# EAGLE design board_rev2 (EAGLE 4.16)
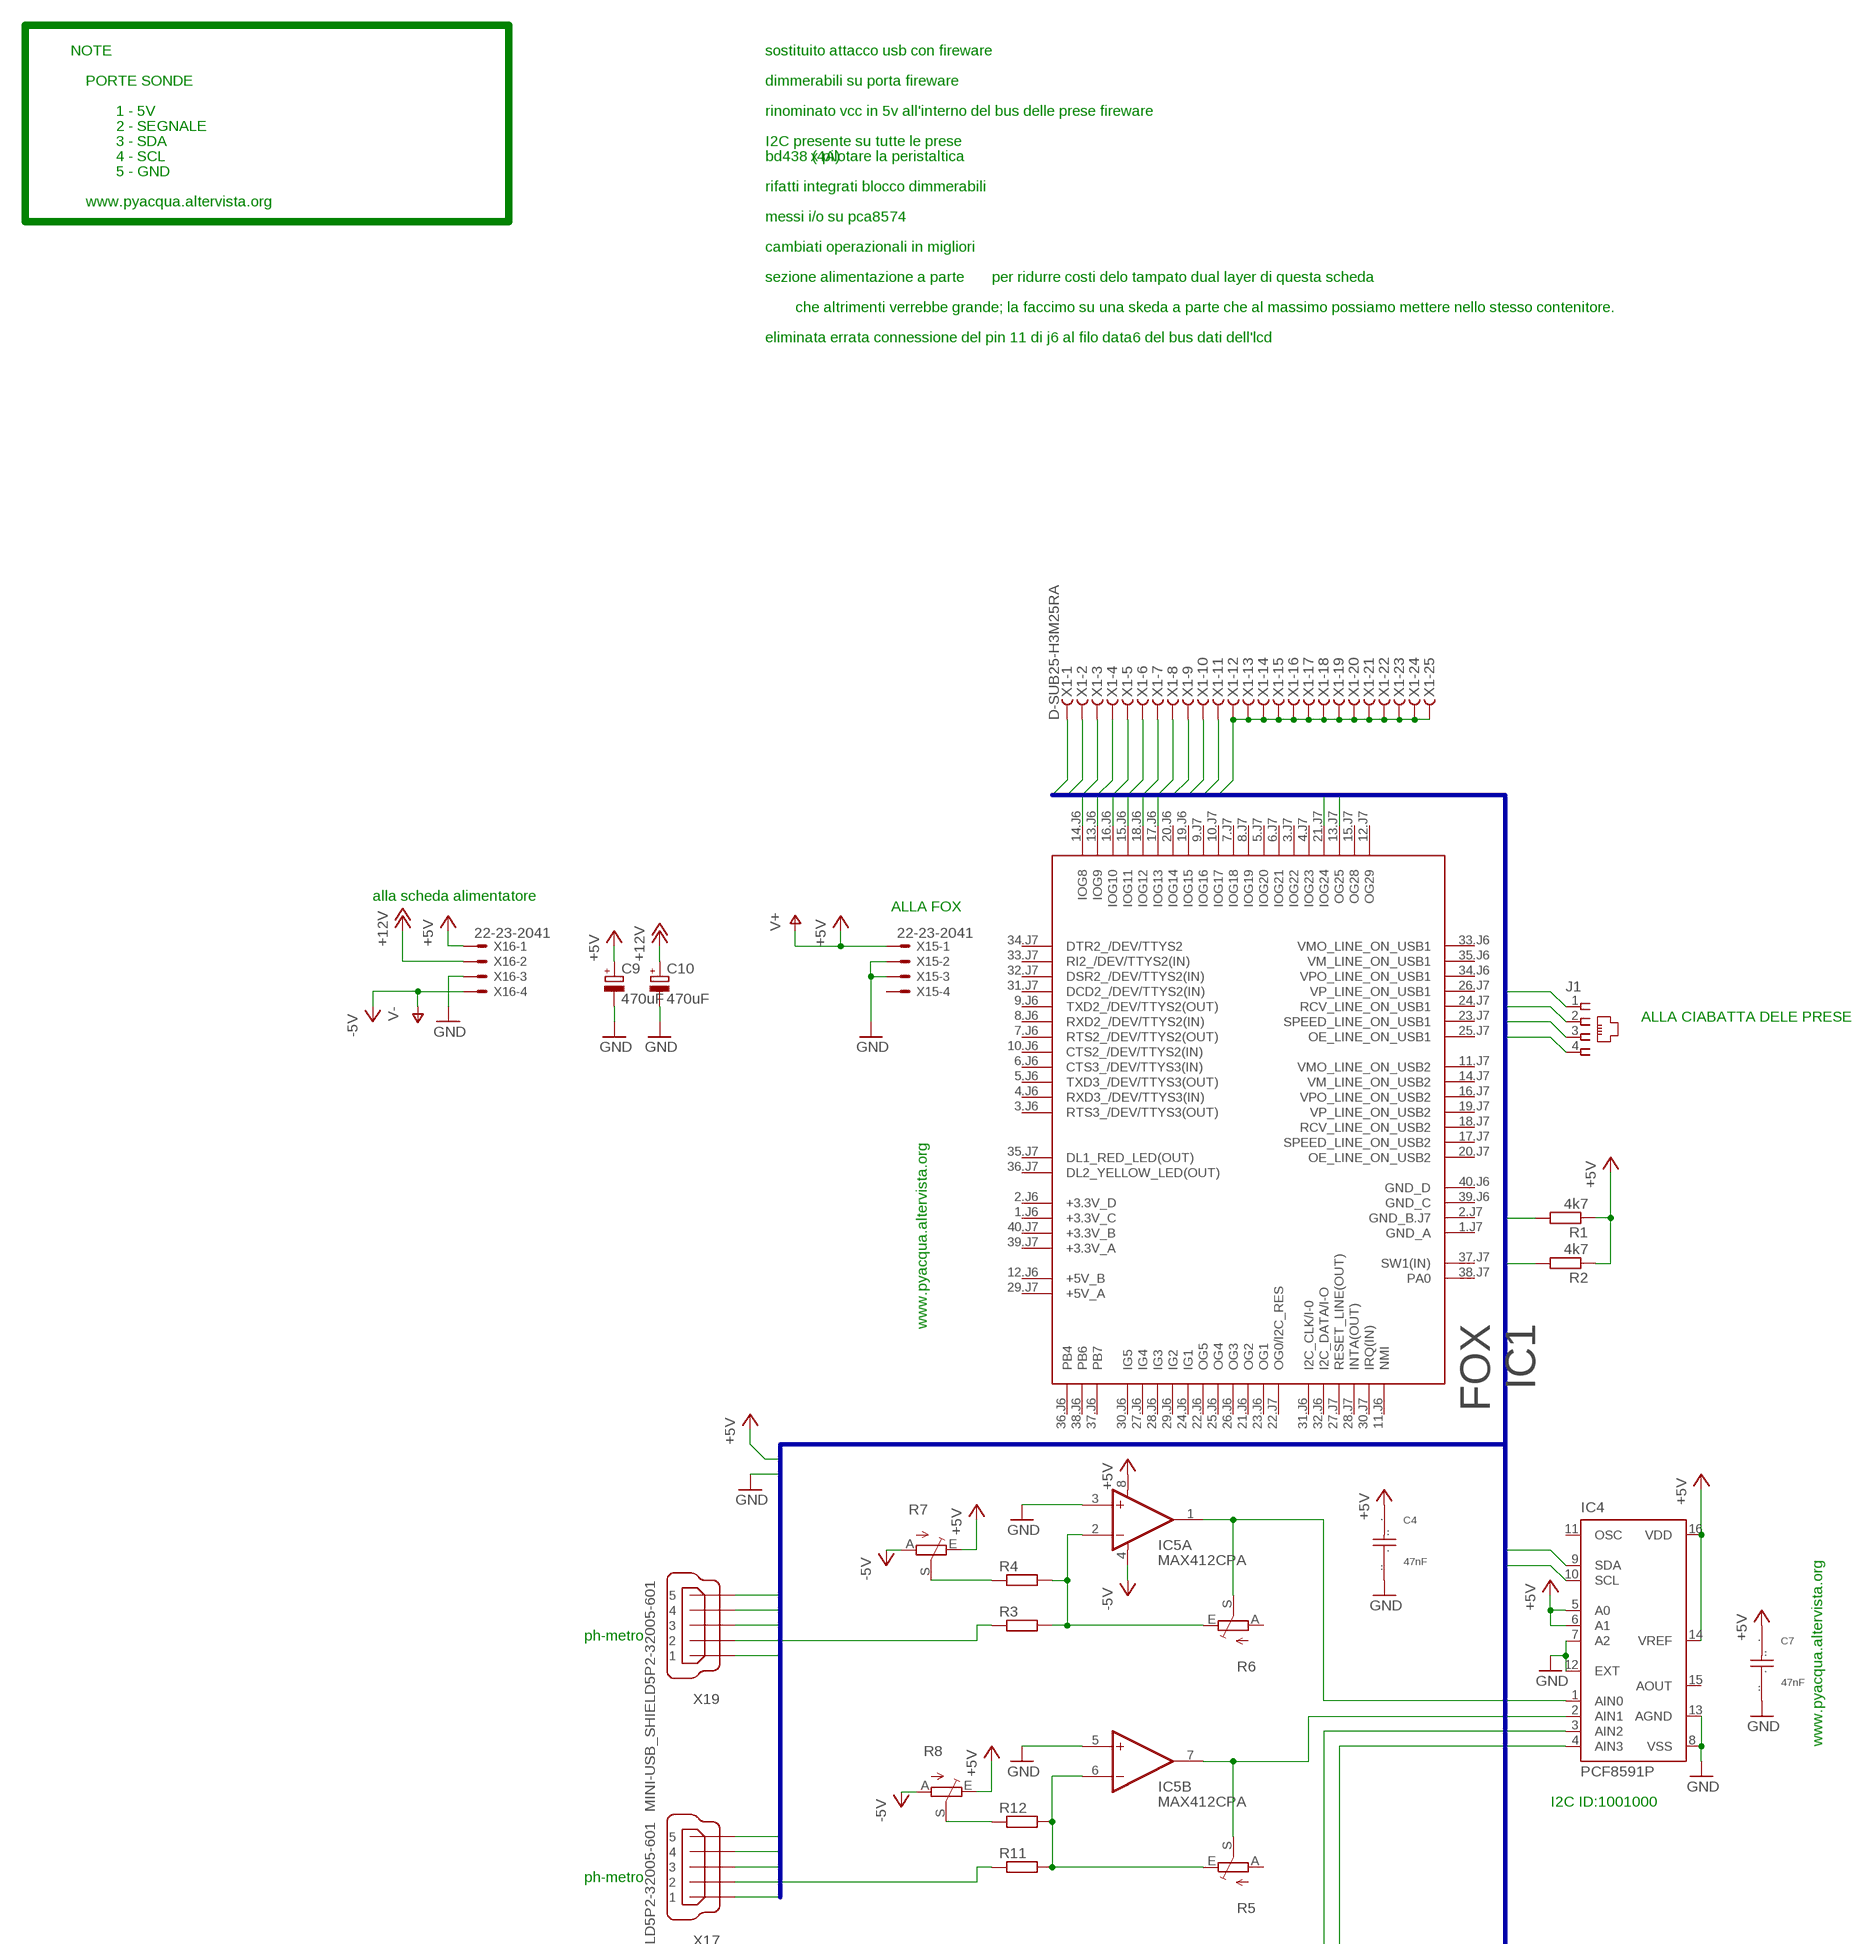
[diagram p0: schematic, sheet 1, part 1 of 2]
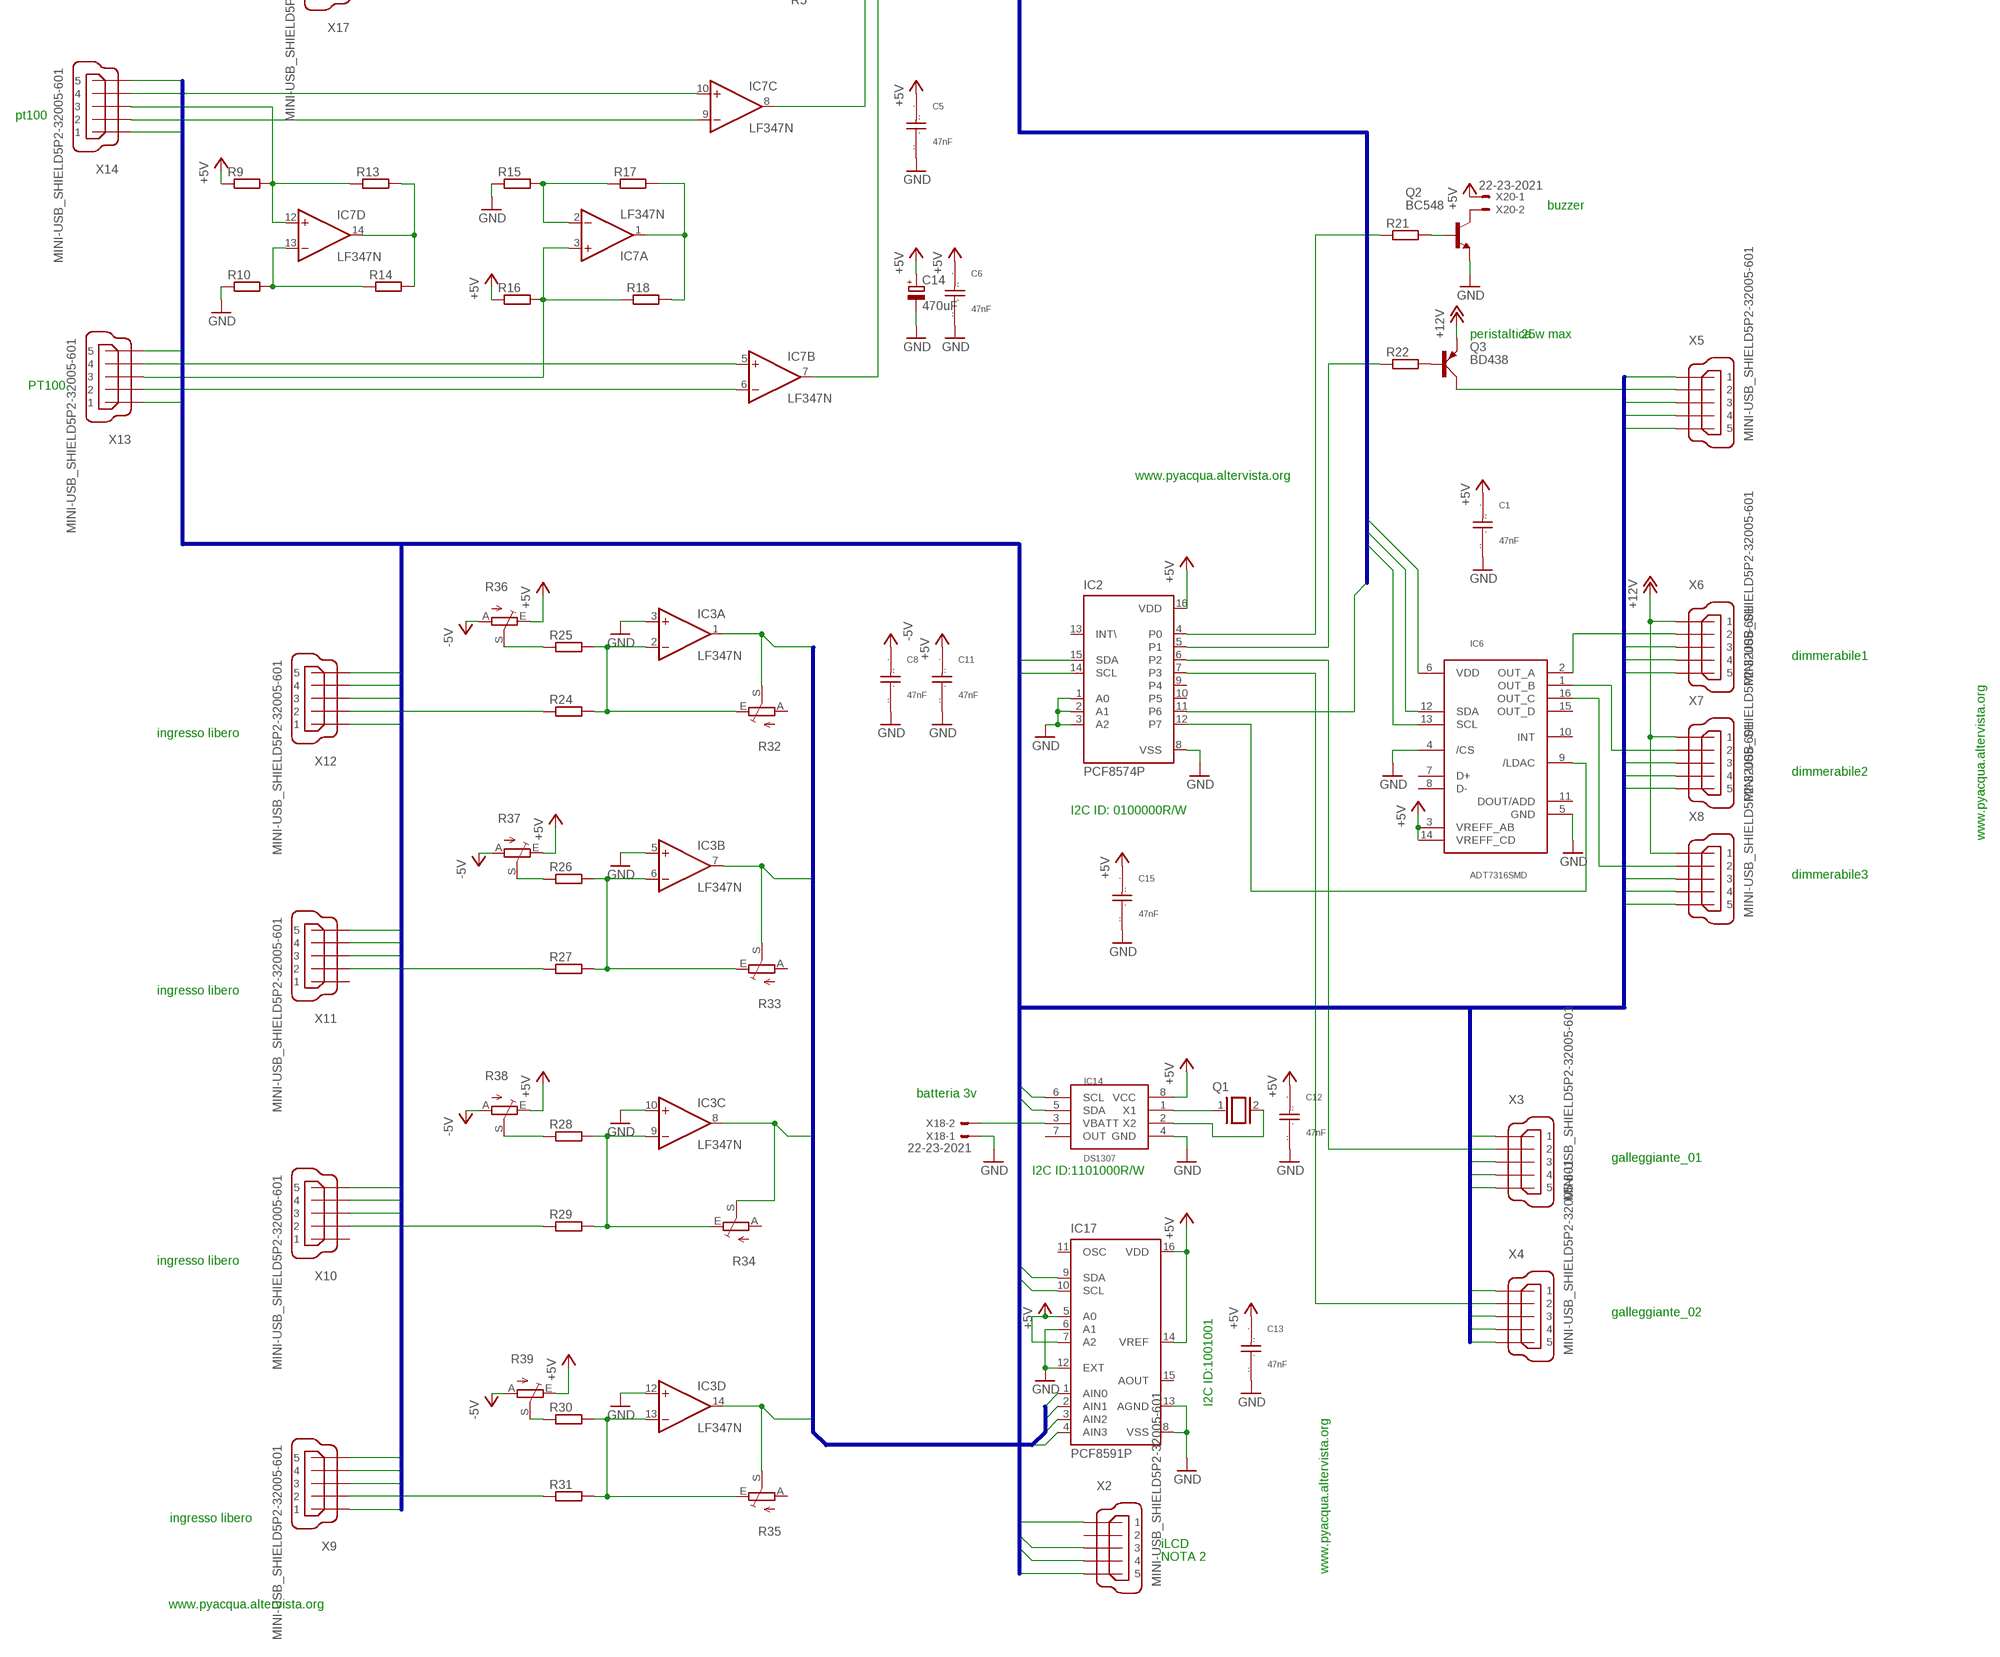
[diagram p1: schematic, sheet 1, part 2 of 2]

## Parts
C1  47nF  CAP_POLI  [CAP_POLI]
C4  47nF  CAP_POLI  [CAP_POLI]
C5  47nF  CAP_POLI  [CAP_POLI]
C6  47nF  CAP_POLI  [CAP_POLI]
C7  47nF  CAP_POLI  [CAP_POLI]
C8  47nF  CAP_POLI  [CAP_POLI]
C9  470uF  CPOL-EUE5-10.5  [E5-10,5]
C10  470uF  CPOL-EUE5-10.5  [E5-10,5]
C11  47nF  CAP_POLI  [CAP_POLI]
C12  47nF  CAP_POLI  [CAP_POLI]
C13  47nF  CAP_POLI  [CAP_POLI]
C14  470uF  CPOL-EUE2.5-6  [E2,5-6]
C15  47nF  CAP_POLI  [CAP_POLI]
IC1  FOX  [FOX]
IC2  PCF8574P  [DIL16]
IC3  LF347N  [DIL14]
IC4  PCF8591P  [DIL16]
IC5  MAX412CPA  [DIL08]
IC6  ADT7316SMD  [ADT7318SMD]
IC7  LF347N  [DIL14]
IC14  DS1307  [DS1307]
IC17  PCF8591P  [DIL16]
J1  520242-2  [520242-2]
Q1  XTAL  [Q]
Q2  BC548  [TO92-EBC]
Q3  BD438  [TO126AV]
R1  4k7  R-EU_0207/10  [0207/10]
R2  4k7  R-EU_0207/10  [0207/10]
R3  R-EU_0207/10  [0207/10]
R4  R-EU_0207/10  [0207/10]
R5  TRIM_EU-CT6  [CT6]
R6  TRIM_EU-CT6  [CT6]
R7  TRIM_EU-B25P  [B25P]
R8  TRIM_EU-B25P  [B25P]
R9  R-EU_0207/10  [0207/10]
R10  R-EU_0207/10  [0207/10]
R11  R-EU_0207/10  [0207/10]
R12  R-EU_0207/10  [0207/10]
R13  R-EU_0207/10  [0207/10]
R14  R-EU_0207/10  [0207/10]
R15  R-EU_0207/10  [0207/10]
R16  R-EU_0207/10  [0207/10]
R17  R-EU_0207/10  [0207/10]
R18  R-EU_0207/10  [0207/10]
R21  R-EU_0207/10  [0207/10]
R22  R-EU_0207/10  [0207/10]
R24  R-EU_0207/10  [0207/10]
R25  R-EU_0207/10  [0207/10]
R26  R-EU_0207/10  [0207/10]
R27  R-EU_0207/10  [0207/10]
R28  R-EU_0207/10  [0207/10]
R29  R-EU_0207/10  [0207/10]
R30  R-EU_0207/10  [0207/10]
R31  R-EU_0207/10  [0207/10]
R32  TRIM_EU-CT6  [CT6]
R33  TRIM_EU-CT6  [CT6]
R34  TRIM_EU-CT6  [CT6]
R35  TRIM_EU-CT6  [CT6]
R36  TRIM_EU-B25P  [B25P]
R37  TRIM_EU-B25P  [B25P]
R38  TRIM_EU-B25P  [B25P]
R39  TRIM_EU-B25P  [B25P]
X1  D-SUB25-H3M25RA  [H3M25RA]
X2  MINI-USB_SHIELD5P2-32005-601  [32005-601]
X3  MINI-USB_SHIELD5P2-32005-601  [32005-601]
X4  MINI-USB_SHIELD5P2-32005-601  [32005-601]
X5  MINI-USB_SHIELD5P2-32005-601  [32005-601]
X6  MINI-USB_SHIELD5P2-32005-601  [32005-601]
X7  MINI-USB_SHIELD5P2-32005-601  [32005-601]
X8  MINI-USB_SHIELD5P2-32005-601  [32005-601]
X9  MINI-USB_SHIELD5P2-32005-601  [32005-601]
X10  MINI-USB_SHIELD5P2-32005-601  [32005-601]
X11  MINI-USB_SHIELD5P2-32005-601  [32005-601]
X12  MINI-USB_SHIELD5P2-32005-601  [32005-601]
X13  MINI-USB_SHIELD5P2-32005-601  [32005-601]
X14  MINI-USB_SHIELD5P2-32005-601  [32005-601]
X15  22-23-2041  [22-23-2041]
X16  22-23-2041  [22-23-2041]
X17  MINI-USB_SHIELD5P2-32005-601  [32005-601]
X18  22-23-2021  [22-23-2021]
X19  MINI-USB_SHIELD5P2-32005-601  [32005-601]
X20  22-23-2021  [22-23-2021]

## Nets
5V: IC6.6(VDD) J1.4 X1.4 X2.1 X3.1 X4.1 X5.1 X9.1 X12.1 X13.1 X14.1 X17.1 X19.1 ; supply symbol labelled +5V
+5V: C1.. C4.. C5.. C6.. C7.. C9.+ C11.. C12.. C13.. C14.+ C15.. IC2.16(VDD) IC4.5(A0) IC4.6(A1) IC4.14(VREF) IC4.16(VDD) IC6.3(VREFF_AB) IC6.14(VREFF_CD) IC14.8(VCC) IC17.5(A0) IC17.7(A2) IC17.14(VREF) IC17.16(VDD) R1.1 R2.1 R7.E R8.E R9.1 R16.1 R36.E R37.E R38.E R39.E X15.1 X16.1 X20.1 ; supply symbol labelled V+
+12V: C10.+ Q3.E X6.1 X7.1 X8.1 X16.2
-5V: C8.. R7.A R8.A R36.A R37.A R38.A R39.A
CH0: IC3.14(D:OUT) IC17.1(AIN0) R35.S
CH1: IC3.8(C:OUT) IC17.2(AIN1) R34.S
CH2: IC3.7(B:OUT) IC17.3(AIN2) R33.S
CH3: IC3.1(A:OUT) IC17.4(AIN3) R32.S
CONTRASTO: IC2.11(P6) X1.5
DATA4: IC1.14.J6(IOG8) X1.8
DATA5: IC1.13.J6(IOG9) X1.9
DATA6: IC1.16.J6(IOG10) X1.10
DATA7: IC1.15.J6(IOG11) X1.11
E: IC1.17.J6(IOG13) X1.6
GND: C1... C4... C5... C6... C7... C8... C9.- C10.- C11... C12... C13... C14.- C15... IC2.1(A0) IC2.2(A1) IC2.3(A2) IC2.8(VSS) IC3.3(A:+IN) IC3.5(B:+IN) IC3.10(C:+IN) IC3.12(D:+IN) IC4.7(A2) IC4.8(VSS) IC4.12(EXT) IC4.13(AGND) IC5.3(A:+IN) IC5.5(B:+IN) IC6.4(/CS) IC6.5(GND) IC14.4(GND) IC17.6(A1) IC17.8(VSS) IC17.12(EXT) IC17.13(AGND) J1.1 Q2.E R10.1 R15.1 X1.3 X1.12 X1.13 X1.14 X1.15 X1.16 X1.17 X1.18 X1.19 X1.20 X1.21 X1.22 X1.23 X1.24 X1.25 X2.5 X3.5 X4.5 X5.5 X6.5 X7.5 X8.5 X9.5 X10.5 X11.5 X12.5 X13.5 X14.5 X15.2 X15.3 X16.3 X17.5 X18.1 X19.5
N$1: IC2.4(P0) R21.1
N$2: IC7.14(D:OUT) R13.2 R14.2
N$3: IC7.1(A:OUT) R17.2 R18.2
N$4: IC7.9(C:-IN) X14.2
N$5: IC7.10(C:+IN) X14.4
N$6: IC7.5(B:+IN) X13.4
N$7: IC7.6(B:-IN) X13.2
N$8: IC7.13(D:-IN) R10.2 R14.1
N$9: IC4.1(AIN0) IC5.1(A:OUT) R6.S
N$10: IC4.2(AIN1) IC5.7(B:OUT) R5.S
N$11: IC2.7(P3) X4.2
N$13: IC4.3(AIN2) IC7.8(C:OUT)
N$14: Q3.B R22.2
N$15: IC6.1(OUT_B) X7.2
N$16: IC2.5(P1) R22.1
N$17: IC6.16(OUT_C) X8.2
N$18: IC2.6(P2) X3.2
N$19: Q3.C X5.2
N$22: IC4.4(AIN3) IC7.7(B:OUT)
N$23: IC6.2(OUT_A) X6.2
N$25: IC2.12(P7) IC6.9(/LDAC)
N$26: Q2.B R21.2
N$27: Q2.C X20.2
N$28: IC7.2(A:-IN) R15.2 R17.1
N$29: IC7.12(D:+IN) R9.2 R13.1 X14.3
N$31: R8.S R12.1
N$32: IC7.3(A:+IN) R16.2 R18.1 X13.3
N$58: IC5.2(A:-IN) R3.2 R4.2 R6.E
N$60: R3.1 X19.2
N$62: R4.1 R7.S
N$63: IC5.6(B:-IN) R5.E R11.2 R12.2
N$69: R11.1 X17.2
N$74: IC14.3(VBATT) X18.2
N$83: IC14.1(X1) Q1.1
N$84: IC14.2(X2) Q1.2
N$113: IC3.2(A:-IN) R24.2 R25.2 R32.E
N$114: IC3.6(B:-IN) R26.2 R27.2 R33.E
N$115: IC3.9(C:-IN) R28.2 R29.2 R34.E
N$116: IC3.13(D:-IN) R30.2 R31.2 R35.E
N$117: R31.1 X9.2
N$119: R29.1 X10.2
N$121: R30.1 R39.S
N$122: R28.1 R38.S
N$123: R26.1 R37.S
N$124: R27.1 X11.2
N$125: R24.1 X12.2
N$126: R25.1 R36.S
RS: IC1.18.J6(IOG12) X1.7
SCL: IC1.13.J7(OG25) IC2.14(SCL) IC4.10(SCL) IC6.13(SCL) IC14.6(SCL) IC17.10(SCL) J1.2 R2.2 X1.2 X2.4 X3.4 X4.4 X5.4 X6.4 X7.4 X8.4 X9.4 X10.4 X11.4 X12.4 X17.4 X19.4
SDA: IC1.21.J7(IOG24) IC2.15(SDA) IC4.9(SDA) IC6.12(SDA) IC14.5(SDA) IC17.9(SDA) J1.3 R1.2 X1.1 X2.3 X3.3 X4.3 X5.3 X6.3 X7.3 X8.3 X9.3 X10.3 X11.3 X12.3 X17.3 X19.3
V-: X16.4 ; supply symbol labelled -5V
Unconnected: IC1.1.J6(+3.3V_C) IC1.1.J7(GND_A) IC1.2.J6(+3.3V_D) IC1.2.J7(GND_B.J7) IC1.3.J6(RTS3_/DEV/TTYS3(OUT)) IC1.3.J7(IOG22) IC1.4.J6(RXD3_/DEV/TTYS3(IN)) IC1.4.J7(IOG23) IC1.5.J6(TXD3_/DEV/TTYS3(OUT)) IC1.5.J7(IOG20) IC1.6.J6(CTS3_/DEV/TTYS3(IN)) IC1.6.J7(IOG21) IC1.7.J6(RTS2_/DEV/TTYS2(OUT)) IC1.7.J7(IOG18) IC1.8.J6(RXD2_/DEV/TTYS2(IN)) IC1.8.J7(IOG19) IC1.9.J6(TXD2_/DEV/TTYS2(OUT)) IC1.9.J7(IOG16) IC1.10.J6(CTS2_/DEV/TTYS2(IN)) IC1.10.J7(IOG17) IC1.11.J6(NMI) IC1.11.J7(VMO_LINE_ON_USB2) IC1.12.J6(+5V_B) IC1.12.J7(OG29) IC1.14.J7(VM_LINE_ON_USB2) IC1.15.J7(OG28) IC1.16.J7(VPO_LINE_ON_USB2) IC1.17.J7(SPEED_LINE_ON_USB2) IC1.18.J7(RCV_LINE_ON_USB2) IC1.19.J6(IOG15) IC1.19.J7(VP_LINE_ON_USB2) IC1.20.J6(IOG14) IC1.20.J7(OE_LINE_ON_USB2) IC1.21.J6(OG2) IC1.22.J6(OG5) IC1.22.J7(OG0/I2C_RES) IC1.23.J6(OG1) IC1.23.J7(SPEED_LINE_ON_USB1) IC1.24.J6(IG1) IC1.24.J7(RCV_LINE_ON_USB1) IC1.25.J6(OG4) IC1.25.J7(OE_LINE_ON_USB1) IC1.26.J6(OG3) IC1.26.J7(VP_LINE_ON_USB1) IC1.27.J6(IG4) IC1.27.J7(RESET_LINE(OUT)) IC1.28.J6(IG3) IC1.28.J7(INTA(OUT)) IC1.29.J6(IG2) IC1.29.J7(+5V_A) IC1.30.J6(IG5) IC1.30.J7(IRQ(IN)) IC1.31.J6(I2C_CLK/I-0) IC1.31.J7(DCD2_/DEV/TTYS2(IN)) IC1.32.J6(I2C_DATA/I-O) IC1.32.J7(DSR2_/DEV/TTYS2(IN)) IC1.33.J6(VMO_LINE_ON_USB1) IC1.33.J7(RI2_/DEV/TTYS2(IN)) IC1.34.J6(VPO_LINE_ON_USB1) IC1.34.J7(DTR2_/DEV/TTYS2) IC1.35.J6(VM_LINE_ON_USB1) IC1.35.J7(DL1_RED_LED(OUT)) IC1.36.J6(PB4) IC1.36.J7(DL2_YELLOW_LED(OUT)) IC1.37.J6(PB7) IC1.37.J7(SW1(IN)) IC1.38.J6(PB6) IC1.38.J7(PA0) IC1.39.J6(GND_C) IC1.39.J7(+3.3V_A) IC1.40.J6(GND_D) IC1.40.J7(+3.3V_B) IC2.9(P4) IC2.10(P5) IC2.13(INT\) IC4.11(OSC) IC4.15(AOUT) IC6.7(D+) IC6.8(D-) IC6.10(INT) IC6.11(DOUT/ADD) IC6.15(OUT_D) IC14.7(OUT) IC17.11(OSC) IC17.15(AOUT) R5.A R6.A R32.A R33.A R34.A R35.A X2.2 X2.M1(S1) X2.M2(S2) X3.M1(S1) X3.M2(S2) X4.M1(S1) X4.M2(S2) X5.M1(S1) X5.M2(S2) X6.M1(S1) X6.M2(S2) X7.M1(S1) X7.M2(S2) X8.M1(S1) X8.M2(S2) X9.M1(S1) X9.M2(S2) X10.1 X10.M1(S1) X10.M2(S2) X11.1 X11.M1(S1) X11.M2(S2) X12.M1(S1) X12.M2(S2) X13.M1(S1) X13.M2(S2) X14.M1(S1) X14.M2(S2) X15.4 X17.M1(S1) X17.M2(S2) X19.M1(S1) X19.M2(S2)

## Buses
BUS:SDA,SCL,GND,5V,DATA[4..7],CONTRASTO,E,RS
AN:CH[0..3]

## Notes on the sheet
- NOTE | sostituito attacco usb con fireware
- PORTE SONDE | dimmerabili su porta fireware
- 1 - 5V | rinominato vcc in 5v all'interno del bus delle prese fireware
- 2 - SEGNALE
- 3 - SDA | I2C presente su tutte le prese
- 4 - SCL | bd438 (4A) | x pilotare la peristaltica
- 5 - GND
- rifatti integrati blocco dimmerabili
- www.pyacqua.altervista.org
- messi i/o su pca8574
- cambiati operazionali in migliori
- sezione alimentazione a parte | per ridurre costi delo tampato dual layer di questa scheda
- che altrimenti verrebbe grande; la faccimo su una skeda a parte che al massimo possiamo mettere nello stesso contenitore.
- eliminata errata connessione del pin 11 di j6 al filo data6 del bus dati dell'lcd
- alla scheda alimentatore | ALLA FOX
- ALLA CIABATTA DELE PRESE
- www.pyacqua.altervista.org
- ph-metro
- www.pyacqua.altervista.org
- I2C ID:1001000
- ph-metro
- pt100
- buzzer
- peristaltica | 25w max
- PT100
- www.pyacqua.altervista.org
- dimmerabile1
- ingresso libero
- dimmerabile2
- I2C ID: 0100000R/W
- www.pyacqua.altervista.org
- dimmerabile3
- ingresso libero
- batteria 3v
- galleggiante_01
- I2C ID:1101000R/W
- ingresso libero
- galleggiante_02
- I2C ID:1001001
- ingresso libero
- iLCD
- NOTA 2
- www.pyacqua.altervista.org
- www.pyacqua.altervista.org

## Power pins joined to a net without a drawn wire
+5V: IC3.4(P:V+) IC5.8(A:V+) IC7.4(P:V+)
V-: IC3.11(P:V-) IC5.4(A:V-) IC7.11(P:V-)

## Library data of the parts
C1 C4-C8 C11-C13 C15 = aggiunte:CAP_POLI: Condensatore non elett 1 piazzola tra i 2 terminali
C9 C10 C14 = rcl:CPOL-EU: POLARIZED CAPACITOR, European symbol
IC1 = aggiunte:FOX: FOXBOARD Un sistema linux embedded completo www.acmesystem.it
IC2 = micro-philips:PCF8574: I2C-Bus Remote 8-bit I/O expander http://www.semiconductors.philips.com/acrobat_download/datasheets/PCF8574_4.pdf
IC3 IC7 = linear:LF347: OP AMP
IC4 IC17 = micro-philips:PCF8591: I2C-Bus D/A CONVERTER
IC5 = maxim:MAX412CPA: OP AMP
IC6 = aggiunte:ADT7316SMD: ADT7318 smd I2C DAC 4 Ch
IC14 = aggiunte:DS1307: DS1307 I2C DEVICE
J1 = con-amp:520242-2: AMP connector
Q1 = special:XTAL: CRYSTAL
Q2 = transistor-npn:BC548*: NPN Transistor
Q3 = transistor-power:BD438: PNP TRANSISTOR
R1-R4 R9-R18 R21 R22 R24-R31 = rcl:R-EU_: RESISTOR, European symbol
R5-R8 R32-R39 = pot:TRIM_EU-: POTENTIOMETER
X1 = con-thomas-betts:D-SUB25-: D-Subminiatur Connector Source: Electronioc Interconnects European Edition 1998
X2-X14 X17 X19 = con-cypressindustries:MINI-USB_SHIELD5P2-: MINI USB-B R/A DIP 5pol. Source: www.cypressindustries.com
X15 X16 = con-molex:22-23-2041: .100" (2.54mm) Center Header - 4 Pin
X18 X20 = con-molex:22-23-2021: .100" (2.54mm) Center Header - 2 Pin

## Board
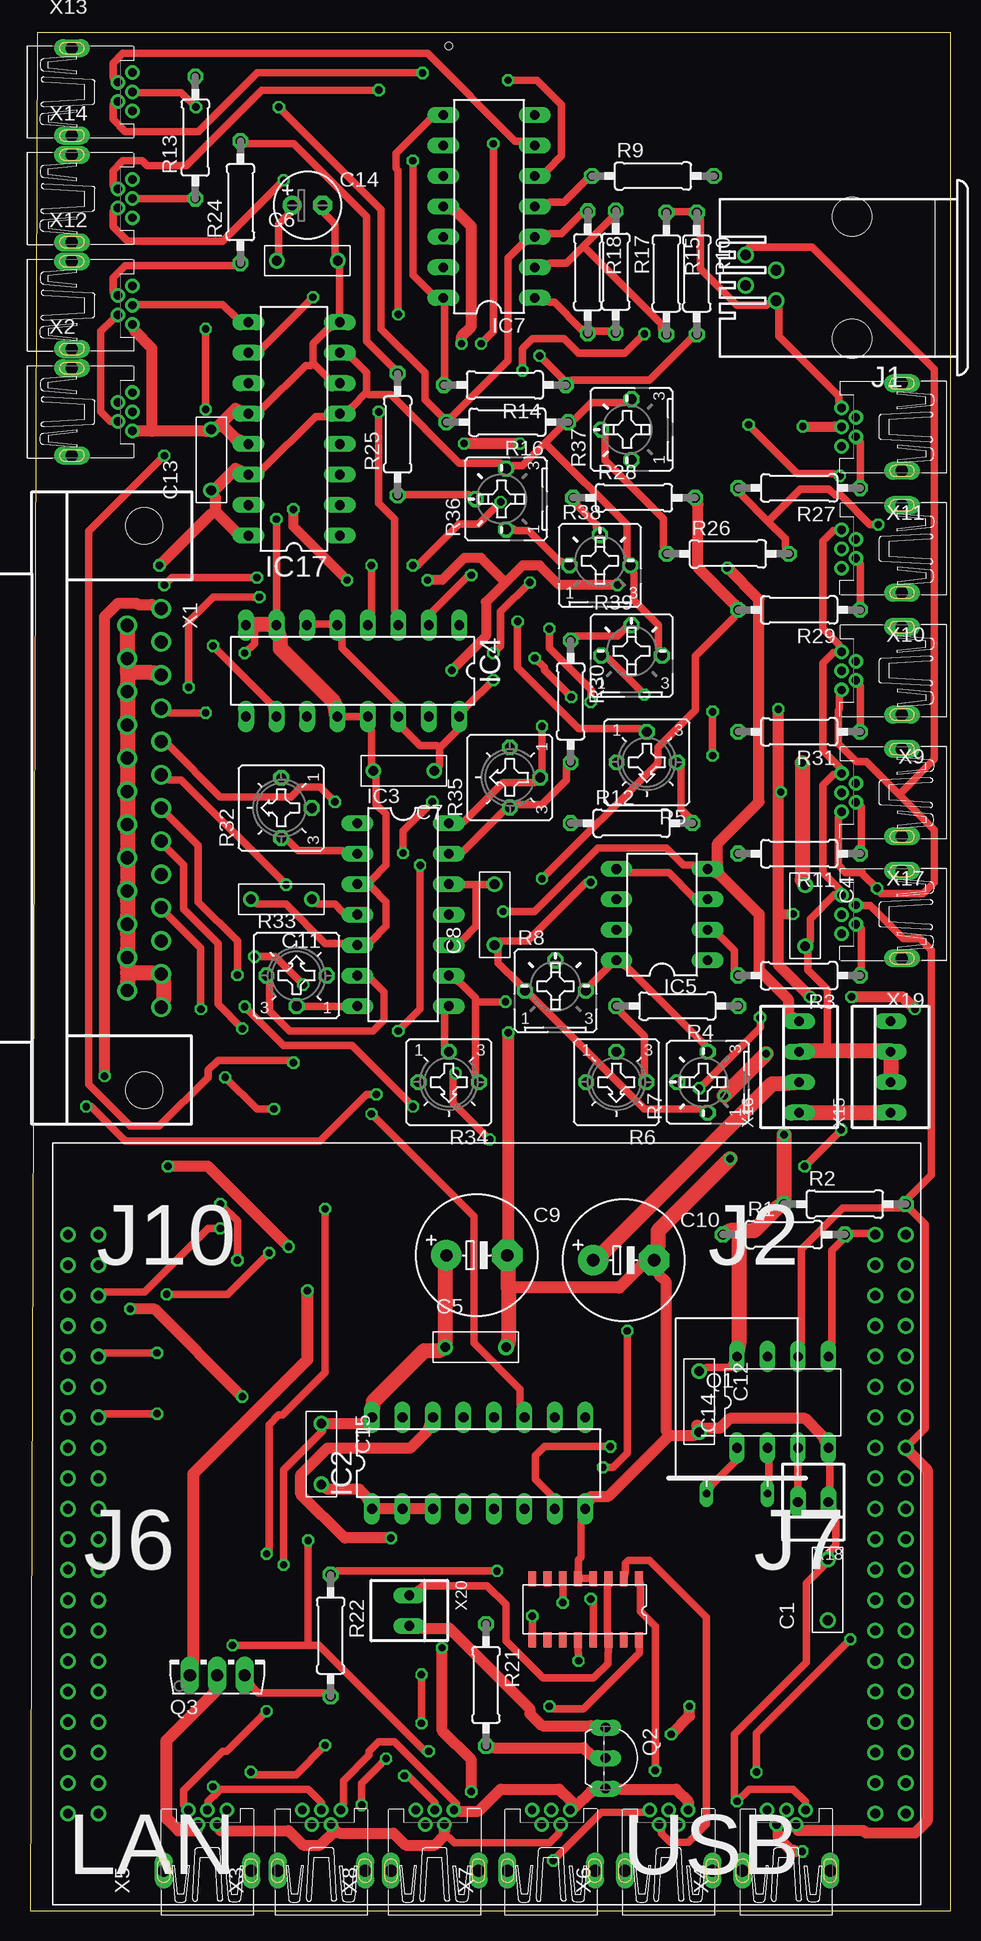
[diagram p2: board, top side]
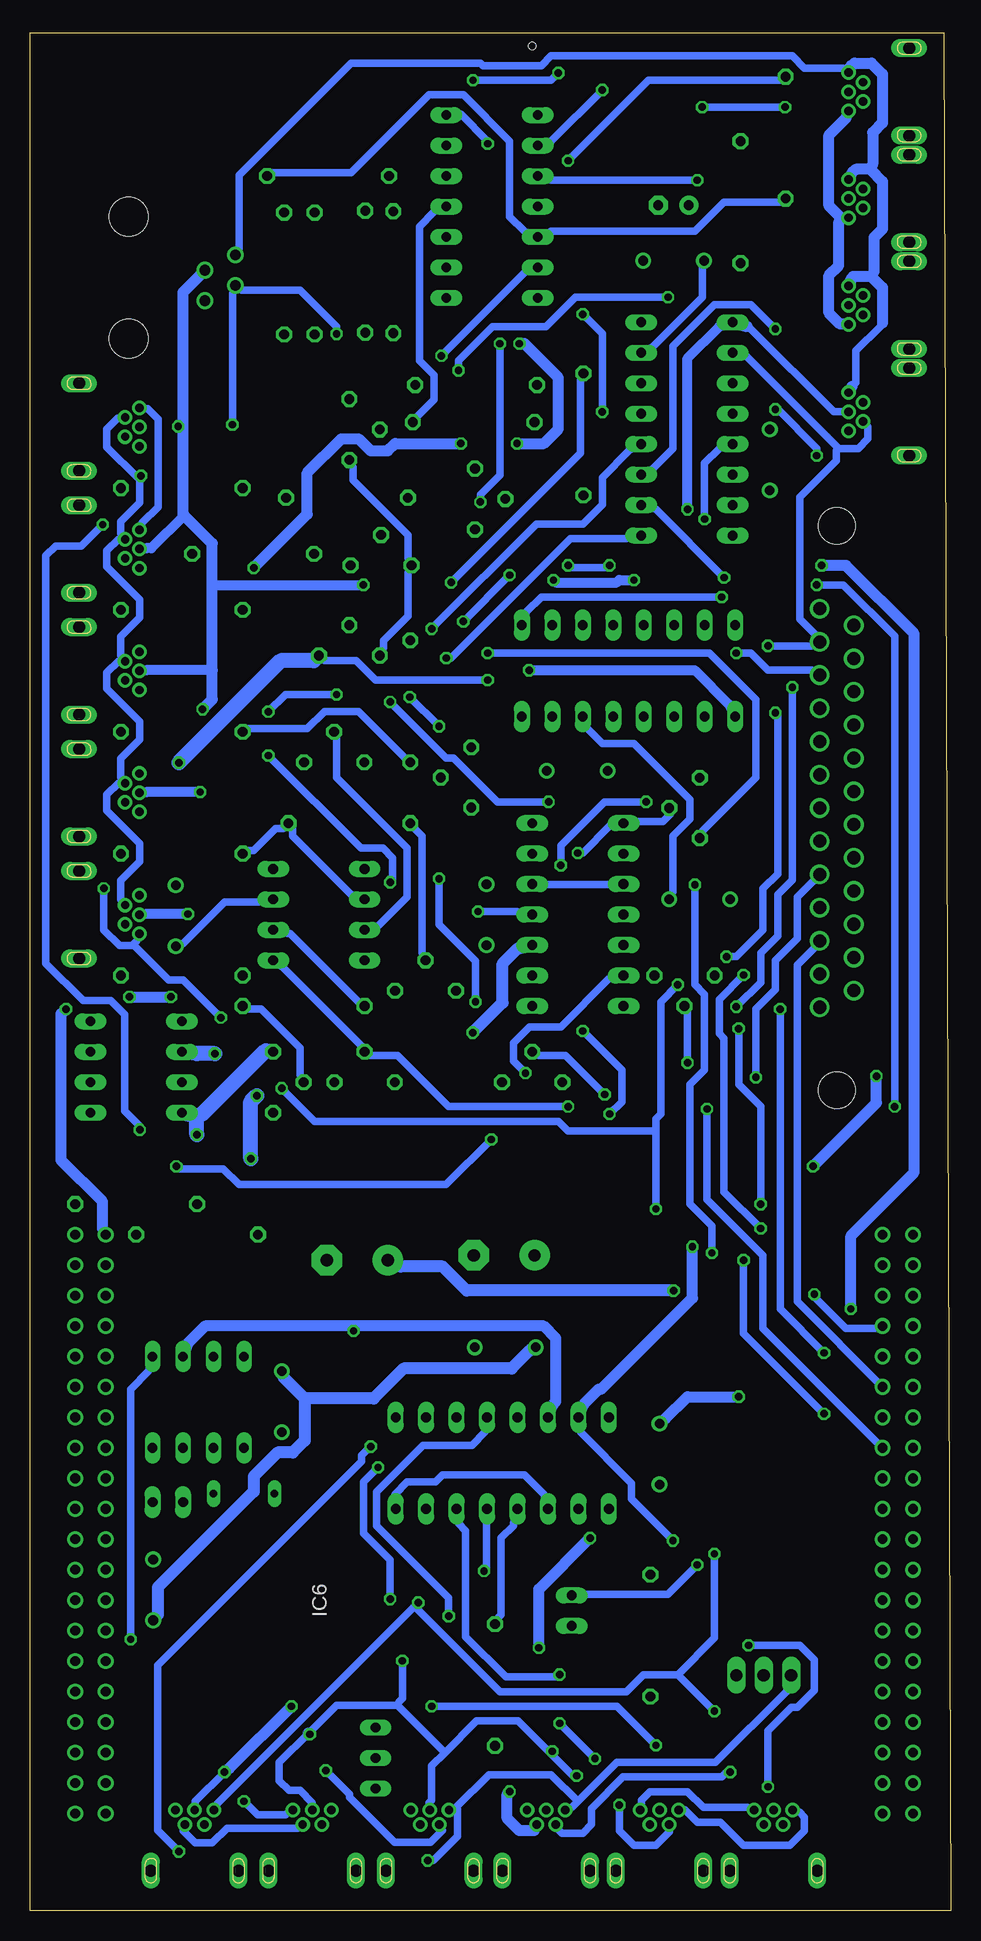
[diagram p3: board, bottom side, seen from below]

Size 76.79 x 156.54 mm. Coordinates in mm from the lower left corner, seen from the top.
Outline: 0,0 76.79,0 76.79,156.54 0.61,156.54 0,0
Copper layers (1*16): Top 0.035mm / dielectric 1.5mm / Bottom 0.035mm
Design rules "design rules": minimum track width 24mil, minimum drill 24mil, track to track 20mil, track to pad 20mil, pad to pad 20mil, via to via 20mil, smd to smd 20mil, copper to edge 40mil, drill to drill 8mil, minimum pad ring 10mil, minimum via ring 8mil, stop-mask expansion 4mil, vias tented up to drill 0mil, thermal gap 10mil
Holes 0.6 mm at 34.92,155.41

### Footprints (pad centres in the part's own frame; a part is rotated, then mirrored left to right if it is on the bottom)
CAP_POLI = drill 0.8 round: . -5.08,0; .. 0,0
E5-10,5 = drill 1.016 pad 2.54 round: + -2.54,0 | drill 1.016 pad 2.54 octagon: - 2.54,0
E2,5-6 = drill 0.813 pad 1.6 round: + -1.27,0 | drill 0.813 pad 1.6 octagon: - 1.27,0
FOX = drill 0.8 pad 1.27 round: 1.J6 67.31,0; 1.J7 0,0; 2.J6 67.31,-2.54; 2.J7 0,-2.54; 3.J6 67.31,-5.08; 3.J7 0,-5.08; 4.J6 67.31,-7.62; 4.J7 0,-7.62; 5.J6 67.31,-10.16; 5.J7 0,-10.16; 6.J6 67.31,-12.7; 6.J7 0,-12.7; 7.J6 67.31,-15.24; 7.J7 0,-15.24; 8.J6 67.31,-17.78; 8.J7 0,-17.78; 9.J6 67.31,-20.32; 9.J7 0,-20.32; 10.J6 67.31,-22.86; 10.J7 0,-22.86; 11.J6 67.31,-25.4; 11.J7 0,-25.4; 12.J6 67.31,-27.94; 12.J7 0,-27.94; 13.J6 67.31,-30.48; 13.J7 0,-30.48; 14.J6 67.31,-33.02; 14.J7 0,-33.02; 15.J6 67.31,-35.56; 15.J7 0,-35.56; 16.J6 67.31,-38.1; 16.J7 0,-38.1; 17.J6 67.31,-40.64; 17.J7 0,-40.64; 18.J6 67.31,-43.18; 18.J7 0,-43.18; 19.J6 67.31,-45.72; 19.J7 0,-45.72; 20.J6 67.31,-48.26; 20.J7 0,-48.26; 21.J6 69.85,-48.26; 21.J7 2.54,-48.26; 22.J6 69.85,-45.72; 22.J7 2.54,-45.72; 23.J6 69.85,-43.18; 23.J7 2.54,-43.18; 24.J6 69.85,-40.64; 24.J7 2.54,-40.64; 25.J6 69.85,-38.1; 25.J7 2.54,-38.1; 26.J6 69.85,-35.56; 26.J7 2.54,-35.56; 27.J6 69.85,-33.02; 27.J7 2.54,-33.02; 28.J6 69.85,-30.48; 28.J7 2.54,-30.48; 29.J6 69.85,-27.94; 29.J7 2.54,-27.94; 30.J6 69.85,-25.4; 30.J7 2.54,-25.4; 31.J6 69.85,-22.86; 31.J7 2.54,-22.86; 32.J6 69.85,-20.32; 32.J7 2.54,-20.32; 33.J6 69.85,-17.78; 33.J7 2.54,-17.78; 34.J6 69.85,-15.24; 34.J7 2.54,-15.24; 35.J6 69.85,-12.7; 35.J7 2.54,-12.7; 36.J6 69.85,-10.16; 36.J7 2.54,-10.16; 37.J6 69.85,-7.62; 37.J7 2.54,-7.62; 38.J6 69.85,-5.08; 38.J7 2.54,-5.08; 39.J6 69.85,-2.54; 39.J7 2.54,-2.54; 40.J6 69.85,0; 40.J7 2.54,0
DIL16 = drill 0.813 long: 1 -8.89,-3.81; 2 -6.35,-3.81; 3 -3.81,-3.81; 4 -1.27,-3.81; 5 1.27,-3.81; 6 3.81,-3.81; 7 6.35,-3.81; 8 8.89,-3.81; 9 8.89,3.81; 10 6.35,3.81; 11 3.81,3.81; 12 1.27,3.81; 13 -1.27,3.81; 14 -3.81,3.81; 15 -6.35,3.81; 16 -8.89,3.81
DIL14 = drill 0.813 long: 1 -7.62,-3.81; 2 -5.08,-3.81; 3 -2.54,-3.81; 4 0,-3.81; 5 2.54,-3.81; 6 5.08,-3.81; 7 7.62,-3.81; 8 7.62,3.81; 9 5.08,3.81; 10 2.54,3.81; 11 0,3.81; 12 -2.54,3.81; 13 -5.08,3.81; 14 -7.62,3.81
DIL08 = drill 0.813 long: 1 -3.81,-3.81; 2 -1.27,-3.81; 3 1.27,-3.81; 4 3.81,-3.81; 5 3.81,3.81; 6 1.27,3.81; 7 -1.27,3.81; 8 -3.81,3.81
ADT7318SMD = smd 0.635 x 1.27: 1 -10.16,-1.27; 2 -8.89,-1.27; 3 -7.62,-1.27; 4 -6.35,-1.27; 5 -5.08,-1.27; 6 -3.81,-1.27; 7 -2.54,-1.27; 8 -1.27,-1.27; 9 -1.27,3.81; 10 -2.54,3.81; 11 -3.81,3.81; 12 -5.08,3.81; 13 -6.35,3.81; 14 -7.62,3.81; 15 -8.89,3.81; 16 -10.16,3.81
DS1307 = drill 0.8 long: 1 -8.89,-5.08; 2 -6.35,-5.08; 3 -3.81,-5.08; 4 -1.27,-5.08; 5 -1.27,2.54; 6 -3.81,2.54; 7 -6.35,2.54; 8 -8.89,2.54
520242-2 = drill 0.889 round: 1 -1.905,6.35; 2 -0.635,8.89; 3 0.635,6.35; 4 1.905,8.89 | hole 3.251: -5.08,0; 5.08,0
Q = drill 0.61 long: 1 -2.54,-7.62; 2 2.54,-7.62
TO92-EBC = drill 0.813 long: B 0,-1.27; C -2.54,-1.27; E 2.54,-1.27
TO126AV = drill 1.016 long: B 2.286,-1.27; C 0,-1.27; E -2.286,-1.27
0207/10 = drill 0.813 octagon: 1 -5.08,0; 2 5.08,0
CT6 = drill 0.813 octagon: A 2.515,0; E -2.515,0; S 0,-2.54
B25P = drill 0.813 octagon: A -2.54,0; E 2.54,0; S 0,2.54
H3M25RA = drill 1.092 round: 1 -16.612,1.422; 2 -13.843,1.422; 3 -11.074,1.422; 4 -8.306,1.422; 5 -5.537,1.422; 6 -2.769,1.422; 7 0,1.422; 8 2.769,1.422; 9 5.537,1.422; 10 8.306,1.422; 11 11.074,1.422; 12 13.843,1.422; 13 16.612,1.422; 14 -15.227,-1.422; 15 -12.459,-1.422; 16 -9.69,-1.422; 17 -6.921,-1.422; 18 -4.153,-1.422; 19 -1.384,-1.422; 20 1.384,-1.422; 21 4.153,-1.422; 22 6.921,-1.422; 23 9.69,-1.422; 24 12.459,-1.422; 25 15.227,-1.422 | hole 3.048: -23.52,0; 23.52,0
32005-601 = drill 0.7 pad 1.016 round: 1 2.825,1.6; 2 1.625,0.8; 3 2.825,0; 4 1.625,-0.8; 5 2.825,-1.6 | drill 1 pad 1.422 long: M1 -2.225,3.65; M2 -2.225,-3.65
22-23-2041 = drill 0.813 long: 1 -3.81,0; 2 -1.27,0; 3 1.27,0; 4 3.81,0
22-23-2021 = drill 0.813 long: 1 -1.27,0; 2 1.27,0

### Placement (x,y rotation side)
C1  66.52,29.27 90 top
C4  64.64,80.38 270 top
C5  39.7,46.95 0 top
C6  25.67,137.53 0 top
C7  28.62,95.01 180 top
C8  38.73,85.56 90 top
C9  37.26,54.62 0 top
C10  49.5,54.22 0 top
C11  18.41,84.29 180 top
C12  55.8,39.89 270 top
C13  15.11,123.46 90 top
C14  23.13,142.15 0 top
C15  24.3,35.52 270 top
IC1  73.02,8.09 180 top
IC2  37.41,37.3 0 top
IC3  31.11,83.02 270 top
IC4  26.89,103.34 180 top
IC5  52.7,83.02 90 top
IC6  40.61,26.38 180 top
IC7  38.27,142.05 90 top
IC14  67.84,43.65 0 top
IC17  22.02,123.51 90 top
J1  68.55,136.11 90 top
Q1  58.95,42.38 0 top
Q2  49.25,12.71 270 top
Q3  15.62,20.89 0 top
R1  62.86,56.35 0 top
R2  67.94,58.89 0 top
R3  64.13,77.94 180 top
R4  53.97,75.4 180 top
R5  51.43,95.72 180 top
R6  48.89,69.05 180 top
R7  56.51,69.05 90 top
R8  43.81,76.67 0 top
R9  51.94,144.59 0 top
R10  55.6,136.46 270 top
R11  64.13,88.1 180 top
R12  50.16,90.64 0 top
R13  13.79,147.79 90 top
R14  39.59,127.17 180 top
R15  53.06,136.46 270 top
R16  39.8,124.07 180 top
R17  48.84,136.61 270 top
R18  46.5,136.56 270 top
R21  38.02,18.81 270 top
R22  25.06,22.92 270 top
R24  17.55,142.41 90 top
R25  30.65,123.05 90 top
R26  58.19,113.09 0 top
R27  64.13,118.58 180 top
R28  50.36,117.77 0 top
R29  64.13,108.42 180 top
R30  45.08,100.8 270 top
R31  64.13,98.26 180 top
R32  20.95,91.91 90 top
R33  22.22,77.94 0 top
R34  34.92,69.05 180 top
R35  40,94.45 90 top
R36  39.7,117.67 90 top
R37  50.16,123.46 90 top
R38  47.52,112.13 0 top
R39  50.16,104.61 0 top
X1  9.52,91.91 270 top
X2  5.71,124.93 0 top
X3  24.3,5.55 90 top
X4  63.06,5.55 90 top
X5  14.8,5.55 90 top
X6  53.26,5.55 90 top
X7  43.45,5.55 90 top
X8  33.75,5.55 90 top
X9  70.48,103.34 180 top
X10  70.48,113.5 180 top
X11  70.48,123.66 180 top
X12  5.71,133.82 0 top
X13  5.71,151.6 0 top
X14  5.71,142.71 0 top
X15  71.75,70.32 90 top
X16  64.13,70.32 90 top
X17  70.48,93.18 180 top
X18  65.3,34.05 180 top
X19  70.48,83.02 180 top
X20  31.62,25.01 270 top

### Tracks (layer width: path | path; a pad name or v marks a point on that pad's centre or on a via)
5V  (via drill 0.61)
  Top 0.61: X17.1 67.38,91.1 67.38,87.14 67.99,86.53 69.41,86.53 69.41,86.42 v70.63,85.2 70.94,84.8 74.49,84.8 75.41,85.71 75.41,90.08 72.46,93.03 | 72.46,93.03 69.72,95.77 68.91,95.77 67.38,97.3 67.38,100.04 67.48,100.14 67.48,101.16 X9.1 | 72.46,93.03 75.41,95.97 75.41,128.49 65.25,138.65 59.96,138.65 J1.4 | v19.73,16.62 16.38,13.27 16.07,13.27 12.82,10.02 12.82,8.8 X5.1 | v44.42,25.67 IC6.6 | v14.65,99.84 11.7,99.84 X1.4 | v18.71,79.52 20.44,79.52 v22.78,77.18 | v24.61,58.48 24.61,44.87 21.05,41.31 20.75,41.31 19.93,40.5 19.93,29.93 v19.73,29.73 | v60.88,74.44 60.88,73.62 v55.8,68.54
  Bottom 0.61: 68.19,80.53 68.3,80.43 69.31,80.43 70.63,81.75 v70.63,85.2 | 68.19,80.53 67.89,80.84 X19.1 | X5.1 12.62,8.19 12.21,7.79 12.21,6.67 13.43,5.45 17.29,5.45 19.22,7.38 21.15,7.38 22.17,8.39 X3.1 | 22.78,19.67 25.62,19.67 27.05,18.25 37.61,18.25 44.42,25.06 v44.42,25.67 61.18,8.9 X4.1 | v19.73,16.62 22.78,19.67 | v14.65,99.84 14.45,99.63 14.45,86.42 15.67,85.2 15.67,81.75 17.9,79.52 v18.71,79.52 | v22.78,77.18 24.2,75.76 24.2,66.41 24.61,66 24.61,64.99 | v24.61,58.48 24.61,64.99 | v19.73,29.73 19.73,22.72 22.78,19.67 | v60.88,74.44 64.03,77.58 65.25,77.58 68.19,80.53 | v55.8,68.54 53.06,65.8 32.74,65.8 31.92,64.99 24.61,64.99 | 8.25,127.06 7.95,127.37 7.95,130.01 5.91,132.04 5.71,132.35 | X13.1 8.96,153.58 12.21,153.58 13.23,154.6 33.35,154.6 34.16,153.78 39.04,153.78 39.24,153.99 50.01,153.99 59.36,144.64 59.36,138.54 J1.4
  Bottom 0.914: 5.71,132.35 5.71,135.29 6.62,136.21 | 6.62,136.21 8.15,136.21 8.35,136 X12.1 | 8.25,127.06 X2.1 | 6.73,145.15 7.95,145.15 8.25,144.84 X14.1 | 6.73,145.15 5.71,144.13 5.71,140.17 6.42,139.46 6.42,136.61 6.62,136.21 | X13.1 8.35,153.78 8.25,153.78 8.05,153.99 6.62,153.99 5.71,153.07 5.71,149.01 6.52,148.2 6.52,145.56 6.73,145.15
+5V  (via drill 0.61)
  Top 0.61: C11.. 24,83.88 25.42,83.88 26.03,83.27 IC3.4 | IC4.6 23.59,107.25 25.01,107.25 IC4.5 26.03,106.03 26.03,105.22 30.5,100.75 IC4.14 31.11,98.51 32.53,97.09 33.96,97.09 34.16,96.89 | 34.16,96.89 34.16,95.47 C7.. | 34.16,96.89 35.58,98.31 IC4.16 36.39,100.34 v38.63,102.58 | R8.E 46.76,77.18 48.18,78.6 IC5.8 49.8,78.6 56.31,72.1 R7.E | X15.1 70.53,66.61 65.25,66.61 X16.1 | C6.. 20.75,138.14 20.75,140.58 21.56,141.39 C14.+ | 28.06,126.56 26.84,125.34 IC17.5 24.61,124.52 23.79,124.52 19.32,120.05 IC17.14 | 28.06,126.56 28.06,128.18 26.84,129.4 IC17.7 | IC7.4 43.3,142.41 44.52,142.41 46.35,144.23 R9.1 | 42.95,122.34 41.07,120.46 40.25,120.46 R36.E 39.24,120.66 35.78,120.66 30.09,126.35 28.27,126.35 28.06,126.56 | 42.95,122.34 44.32,123.71 R16.1 45.49,124.37 46.81,125.69 49.55,125.69 R37.E | C12.. 56.41,45.28 58.34,45.28 IC14.8 | R39.E 52.4,105.22 52.4,107.15 50.36,109.18 50.36,111.52 R38.E 49.75,112.74 49.75,115.53 42.95,122.34 | 28.06,40.6 IC2.16 | v21.15,28.82 21.15,36.74 24.4,39.99 C15.. | X20.1 32.56,26.91 32.74,27.09 38.1,27.09 39.67,25.51 39.67,22.49 42.77,19.39 46.98,19.39 48.18,20.59 48.18,21.5 48.23,21.55 48.23,21.91 48.26,21.93 48.26,21.96 IC6.14 48.13,23.18 48.13,27.18 IC6.3
  Top 0.914: 15.46,116.6 17.09,114.97 IC17.16 | 15.46,116.6 15.46,117.82 C13.. | v10.79,112.13 15.06,116.4 15.46,116.6 | v8.35,50.15 10.38,50.15 v17.7,42.84 | C15.. 28.06,40.6
  Top 1.016: C13.. 15.63,118.68 17.13,120.18 IC17.14
  Top 1.27: 59.13,56.68 60.38,56.68 62.38,58.68 R2.1 62.88,59.43 v62.88,64.68 | 59.13,56.68 58.38,56.68 R1.1 | 59.13,56.68 59.13,47.43 IC14.8 | C9.+ 34.63,53.43 34.63,47.43 C5.. 34.13,46.68 32.88,46.68 28.63,42.43 IC2.16 | v64.38,95.68 64.38,85.93 C4..
  Bottom 0.61: C11.. 23.18,84.9 23.18,89.57 21.76,91 21.76,92.62 26.44,97.3 29.08,97.3 30.3,98.51 IC4.14 | v38.63,102.58 47.98,102.58 49.6,104.2 52.24,104.2 R39.E | C6.. 20.75,136.92 20.75,134.48 24.81,130.42 IC17.7 | IC7.4 43.1,141.59 44.32,140.37 44.32,129.2 43.1,127.98 43.1,125.95 44.52,124.52 R16.1 | v21.15,28.82 23.59,26.38 30.5,26.38 X20.1
  Bottom 0.914: v10.79,112.13 8.76,112.13 3.07,106.44 3.07,61.53 8.35,56.25 v8.35,50.15 | v17.7,42.84 21.97,42.84 23.79,41.01 C15..
  Bottom 1.016: 53.88,42.68 53.88,39.18 54.88,38.18 56.13,38.18 58.13,36.18 58.13,34.93 66.13,26.93 66.13,24.68 C1.. | 53.88,42.68 55.63,44.43 C12.. | 53.88,42.68 48.13,42.68 45.63,45.18 36.63,45.18 35.13,46.68 C5..
  Bottom 1.27: v62.88,64.68 62.88,66.18 | 62.88,66.18 X16.1 | 62.88,66.18 62.38,66.43 57.13,71.68 R7.E | v64.38,95.68 55.88,104.18 53.13,104.18 R39.E
+12V  (via drill 0.61)
  Top 0.61: v43.63,4.18 47.63,8.18 51.13,8.18 X6.1
  Top 1.016: v23.13,51.68 23.13,45.93 13.63,36.43 13.63,20.93 Q3.E
  Top 1.27: X16.2 62.88,68.93 61.88,68.93 47.88,54.93 C10.+
  Bottom 0.61: 31.11,9.11 27.86,12.36 19.63,12.36 13.74,18.25 Q3.E | 31.11,9.11 31.62,8.6 X8.1 | 41.27,8.6 38.53,11.34 33.35,11.34 31.11,9.11 | 41.27,8.6 X7.1 | v43.63,4.18 43.13,4.18 41.13,6.18 41.13,8.43 41.27,8.6
  Bottom 1.016: v23.13,51.68 40.38,51.68 42.38,53.68 45.88,53.68 C10.+
-5V  (via drill 0.61)
  Top 0.61: R7.A 55.9,66.82 51.23,66.82 41.68,76.37 R8.A 40.86,77.18 39.04,79.01 39.04,80.02 C8.. 39.24,80.84 41.47,80.84 46.35,85.71 v46.76,85.71 | R36.A 40.25,115.18 40.51,115.02 41.58,115.02 44.17,112.43 44.37,112.43 R38.A | v51.23,101.36 48.18,104.41 R39.A | v56.92,96.28 v56.92,99.94
  Bottom 0.61: v51.23,101.36 55.49,101.36 v56.92,99.94 | v56.92,96.28 49.2,88.56 47.37,88.56 46.55,87.74 46.55,85.92 v46.76,85.71 | R37.A 49.86,120.31 49.86,119.24 45.28,114.67 45.28,112.74 R38.A 45.28,111.52 45.28,107.91 47.32,105.88 47.32,105.22 R39.A
CH0  (via drill 0.61)
  Top 0.61: IC3.14 36.19,90.79 39.44,94.04 42.08,94.04 R35.S 42.69,95.06 v42.69,98.72 | v42.08,104.41 42.9,103.59 42.9,103.39 v45.13,101.16
  Bottom 0.61: v42.08,104.41 41.68,104.41 31.72,114.36 27.05,114.36 IC17.1 | v42.69,98.72 v45.13,101.16
CH1  (via drill 0.61)
  Top 0.61: R34.S 34.56,72.1 34.56,74.94 IC3.8 | v18.92,111.11 11.81,111.11 v11.2,110.5 | v4.69,67.02 5.1,67.02 7.95,64.17 24.2,64.17 28.06,68.03 v28.88,68.03
  Bottom 0.61: v18.92,111.11 24.61,116.8 IC17.2 | v11.2,110.5 8.96,110.5 4.69,106.24 v4.69,67.02 | v28.88,68.03 32.13,71.29 34.36,71.29 R34.S
CH2  (via drill 0.61)
  Top 0.61: R33.S 22.78,75.35 26.03,75.35 IC3.7 | v14.65,125.13 v14.65,131.84 | v11.2,121.27 4.9,114.97 4.9,68.85 8.35,65.39 10.79,65.39 14.85,69.46 14.85,70.07 15.67,70.88 21.76,70.88 v21.97,70.68
  Bottom 0.61: v14.65,131.84 16.68,133.87 19.73,133.87 23.18,130.42 23.18,121.88 24.81,120.26 IC17.3 | v14.65,125.13 14.45,125.13 11.2,121.88 v11.2,121.27 | v21.97,70.68 21.97,74.94 R33.S
CH3  (via drill 0.61)
  Top 0.61: v43.3,106.85 43.3,105.22 46.76,101.77 v46.76,100.75 | v33.55,92.42 31.11,89.98 v31.11,88.15
  Bottom 0.61: R32.S 23.39,91.4 24,90.79 26.03,90.79 IC3.1 28.47,90.39 30.7,88.15 v31.11,88.15 | v43.3,106.85 34.56,115.58 30.7,115.58 29.08,117.21 29.08,119.44 26.84,121.68 IC17.4 | v46.76,100.75 42.08,96.08 41.47,96.08 37.82,92.42 v33.55,92.42
CONTRASTO  (via drill 0.61)
  Top 0.61: v28.47,66.41 37,57.87 37,47.31 40.86,43.45 40.86,42.23 IC2.11 | v30.7,73.32 32.53,75.15 v32.53,87.14 | v25.42,92.42 24.2,93.64 22.58,93.64 21.76,92.82 15.87,92.82 11.6,97.09 X1.5
  Bottom 0.61: v28.47,66.41 27.45,67.42 27.45,70.07 v30.7,73.32 | v32.53,87.14 32.53,88.76 28.88,92.42 v25.42,92.42
DATA4  (via drill 0.61)
  Top 0.61: v10.59,41.41 6.32,41.41 IC1.14.J6 | v17.29,54.22 17.29,57.47 v15.87,58.89 | v17.7,73.52 15.67,75.55 15.67,80.63 12.82,83.48 12.82,87.14 11.4,88.56 X1.8
  Bottom 0.61: v10.59,41.41 17.29,48.12 v17.29,54.22 | v15.87,58.89 15.87,67.02 17.7,68.85 v17.7,73.52
DATA5  (via drill 0.61)
  Top 0.61: v20.34,66.82 18.92,66.82 v16.28,69.46
  Bottom 0.61: v20.34,66.82 20.34,59.3 15.67,54.62 15.67,48.53 IC1.13.J6 | v16.28,69.46 16.28,75.15 14.65,76.77 14.65,79.21 12.82,81.04 12.82,84.49 X1.9
DATA6  (via drill 0.61)
  Top 0.61: v10.59,46.49 6.32,46.49 IC1.16.J6 | v14.24,75.15 14.24,80.23 11.4,83.07 X1.10
  Bottom 0.61: v10.59,46.49 14.24,50.15 v14.24,75.15
DATA7
  Bottom 0.61: IC1.15.J6 12.82,50.76 12.82,78.8 11.4,80.23 X1.11
E  (via drill 0.61)
  Top 0.61: v11.4,51.37 16.48,51.37 v19.93,54.83 | v21.36,85.51 12.62,94.25 11.6,94.25 X1.6
  Bottom 0.61: v11.4,51.37 11.4,51.17 8.76,48.53 6.32,48.53 IC1.17.J6 | v19.93,54.83 19.93,57.06 21.76,58.89 21.76,68.85 20.54,70.07 20.54,76.37 21.36,77.18 v21.36,85.51
GND  (via drill 0.61)
  Top 0.61: IC14.4 66.67,37.35 66.67,35.32 X18.1 67.18,33.08 67.18,30.44 66.57,29.83 C1... 66.16,28.71 64.74,27.29 64.74,20.69 58.75,14.69 58.75,9.51 v58.95,9.11 59.96,10.12 63.62,10.12 64.64,9.11 64.64,8.9 X4.5 | IC5.5 50.01,86.53 53.26,86.53 55.29,84.49 IC5.3 | IC4.12 IC4.13 28.47,98.31 28.47,95.47 C7... 28.88,94.45 28.88,92.22 29.69,91.4 29.69,87.14 28.47,85.92 IC3.3 28.47,85.31 29.69,84.09 29.69,82.06 28.47,80.84 IC3.5 26.03,80.63 24.61,80.63 21.36,83.88 18.92,83.88 C11... | 37.21,85.51 36.19,85.51 IC3.12 | 37.21,85.51 38.22,85.51 C8... | IC3.10 35.99,80.84 37.21,82.06 37.21,85.51 | 66.47,71.69 70.53,71.69 X15.3 71.75,71.49 | 66.47,71.69 65.25,71.69 X16.3 | 66.47,71.69 66.47,76.77 64.84,78.4 64.84,79.82 C4... 65.04,80.84 65.04,82.66 67.08,84.7 X19.5 67.43,85.2 66.11,86.53 66.11,93.84 66.97,94.7 67.08,94.7 X17.5 67.43,95.36 66.11,96.69 66.11,104 66.97,104.86 67.08,104.86 X9.5 67.43,105.52 66.11,106.85 66.11,114.16 66.97,115.02 67.08,115.02 X10.5 | C14.- 24.61,141.39 25.42,140.58 25.42,138.14 C6... 25.83,136.92 IC17.8 24.81,131.84 23.59,130.62 23.59,128.99 | 23.59,128.99 24.81,127.78 IC17.6 | 23.59,128.99 23.39,128.79 22.98,128.79 19.32,125.13 IC17.12 | R15.1 53.66,141.59 55.09,141.59 R10.1 55.9,140.93 55.9,136.87 58.95,133.82 61.44,133.82 61.54,133.92 J1.1 62.45,133.52 62.45,131.23 67.43,126.25 67.43,125.84 X11.5 | IC4.7 v20.54,115.99 | IC6.4 46.66,27.7 45.94,27.7 IC6.5 45.74,28.21 45.74,29.22 45.94,29.43 45.94,32.27 IC2.8 | X3.5 26.13,8.9 26.13,10.83 28.27,12.97 28.27,13.27 29.08,14.08 30.4,14.08 35.58,8.9 X8.5 | v17.9,104.81 18.71,105.63 18.71,107.18
  Top 0.914: 10.18,123.3 14.65,123.3 C13... | 10.18,123.3 8.96,123.3 X2.5 | 10.18,123.3 10.18,130.21 8.76,131.64 X12.5 | IC14.4 66.06,39.59 64.64,41.01 58.34,41.01 57.53,40.2 56.31,40.2 C12... 55.29,39.59 53.26,39.59 | 53.26,39.59 48.18,34.51 46.76,34.51 IC2.8 | 53.26,39.59 53.06,39.99 53.06,52.39 52.45,53 C10.- | C15... 24.81,35.12 27.45,35.12 28.06,34.51 IC2.1 IC2.2 IC2.3 | X6.5 54.88,8.9 54.88,9.11 53.87,10.12 49.2,10.12 Q2.E 46.76,9.92 45.54,8.7 X7.5 45.13,8.9 45.13,9.11 44.12,10.12 39.24,10.12 37.41,8.29 35.78,8.29 X8.5
  Top 1.016: C12... 55.63,40.43 | 39.88,51.93 49.13,51.93 50.88,53.68 C10.- | v39.88,73.18 39.88,55.68 C9.- | 15.88,123.93 17.13,125.18 IC17.12 | 15.88,123.93 15.63,123.68 C13... | 15.88,123.93 17.13,122.68 IC17.13
  Top 1.27: 71.75,71.49 X15.2 | C5... 39.88,47.43 39.88,51.93 39.88,53.43 C9.- | v58.38,62.68 52.38,56.68 52.38,55.43 C10.- | v57.88,67.93 v61.38,71.43 | IC4.8 18.63,107.18 18.71,107.18 20.13,107.18 IC4.7 20.88,105.93 20.88,105.18 25.38,100.68 IC4.12 | X1.13 11.13,75.93 11.13,77.43 X1.12 10.13,78.18 8.13,78.18 | X1.14 8.13,106.43 8.13,105.18 X1.15 8.13,103.68 8.13,103.18 | 8.13,78.18 8.13,78.68 X1.24 8.13,80.18 8.13,81.43 X1.23 8.13,82.93 8.13,84.18 X1.22 8.13,85.68 8.13,87.18 X1.21 8.13,88.43 8.13,89.93 X1.20 8.13,91.18 8.13,92.68 X1.19 8.13,93.93 8.13,95.43 X1.18 8.13,96.68 8.13,98.18 X1.17 8.13,99.43 8.13,100.93 X1.16 8.13,102.18 8.13,103.18 | 8.13,78.18 8.13,77.43 X1.25 | X1.3 10.13,103.18 8.13,103.18
  Bottom 0.61: IC3.3 28.47,85.51 33.75,85.51 IC3.12 | v20.54,115.99 20.54,120.66 19.32,121.88 IC17.13 | IC5.3 57.73,84.09 60.57,84.09 64.03,80.63 C4... | X3.5 25.83,8.9 25.83,9.21 25.12,9.92 21.97,9.92 20.64,8.6 16.99,8.6 X5.5 | X11.5 67.08,125.18 66.97,125.18 66.11,124.32 66.11,117.01 67.43,115.68 X10.5 | v58.95,9.11 57.83,7.99 55.49,7.99 55.39,8.09 X6.5 | IC2.3 33.96,34.71 35.58,36.34 42.39,36.34 43,35.73 45.33,35.73 46.35,34.71 IC2.8 | v17.9,104.81 16.68,104.81 15.26,103.39 11.6,103.39 X1.3
  Bottom 0.914: 9.16,141.08 9.06,141.08 X14.5 | 9.16,141.08 10.18,142.1 10.18,147.99 8.76,149.42 X13.5 | 9.16,141.08 9.37,140.68 9.37,137.12 10.18,136.31 10.18,133.16 9.27,132.25 9.06,132.25 X12.5
  Bottom 1.016: v39.88,73.18 37.38,75.68 37.38,78.93 36.13,80.18 IC3.10
  Bottom 1.27: v58.38,62.68 58.38,67.43 v57.88,67.93 | v61.38,71.43 62.88,71.43 X16.3
N$1
  Bottom 0.61: R21.1 37.71,24.45 37.51,24.65 37.51,31.05 36.5,32.07 36.5,32.27 IC2.4
N$2  (via drill 0.61)
  Top 0.61: R14.2 34.56,127.78 34.56,133.87 IC7.14 33.35,134.89 31.92,136.31 v31.92,145.86
  Bottom 0.61: v31.92,145.86 25.22,152.56 14.24,152.56 R13.2
N$3
  Top 0.61: R17.2 48.38,131.64 46.96,131.64 R18.2 45.94,131.84 43.71,134.07 43.3,134.07 IC7.1
N$4  (via drill 0.61)
  Top 0.61: v29.08,151.75 19.32,151.75 13.03,145.45 9.77,145.45 9.37,145.86 7.74,145.86 6.93,145.05 6.93,143.83 X14.2
  Bottom 0.61: v29.08,151.75 33.35,147.49 IC7.9
N$5  (via drill 0.61)
  Top 0.61: v21.15,144.23 16.07,139.15 8.15,139.15 6.93,140.37 6.93,141.59 X14.4
  Bottom 0.61: v21.15,144.23 33.35,144.23 IC7.10
N$6  (via drill 0.61)
  Top 0.61: v32.74,153.18 18.92,153.18 14.04,148.3 7.95,148.3 6.93,149.31 6.93,150.53 X13.4 | v39.85,152.56 42.29,152.56 44.32,150.53 44.32,146.27 43.1,145.05 IC7.5
  Bottom 0.61: v32.74,153.18 33.35,152.56 v39.85,152.56
N$7
  Top 0.61: X13.2 6.93,152.77 6.93,153.99 7.74,154.8 33.14,154.8 40.46,147.49 40.86,147.49 IC7.6
N$8  (via drill 0.61)
  Top 0.61: R10.2 55.09,131.03 51.63,127.57 45.13,127.57 R14.1 44.52,127.57 v42.49,129.6
  Bottom 0.61: v42.49,129.6 35.58,136.51 IC7.13
N$9  (via drill 0.61)
  Top 0.61: v19.12,109.49 15.26,109.49 13.23,107.46 v13.23,101.97 | v17.9,75.35 21.15,72.1 26.84,72.1 v31.92,67.02
  Bottom 0.61: IC5.1 55.7,78.6 49.2,72.1 R6.S 48.38,71.29 46.15,71.29 41.88,67.02 v31.92,67.02 | v19.12,109.49 34.16,109.49 35.38,108.27 IC4.1 | v13.23,101.97 13.23,85.92 14.45,84.7 14.45,81.24 15.87,79.82 15.87,77.38 v17.9,75.35
N$10  (via drill 0.61)
  Top 0.61: v36.8,111.32 36.6,111.32 33.55,108.27 IC4.2 | v40.66,107.46 40.66,103.59 45.74,98.51 50.82,98.51 R5.S
  Bottom 0.61: IC5.7 47.77,82.06 45.33,84.49 45.33,88.56 51.23,94.45 51.23,97.7 R5.S | v40.66,107.46 v36.8,111.32
N$11  (via drill 0.61)
  Top 0.61: 62.38,6.43 62.38,6.68 X4.2 | 63.88,4.93 v64.38,4.93 | v48.38,38.68 42.88,38.68 42.13,37.93 42.13,35.93 43.38,34.68 IC2.7
  Top 0.914: 62.38,6.43 62.4,6.26 62.4,6.06 63.42,5.04 63.62,5.04 63.88,4.93
  Bottom 0.61: v64.38,4.93 66.13,6.68 66.13,20.43 49.13,37.43 49.13,37.93 v48.38,38.68
N$12
  Top 1.27: 71.75,71.69 64.23,71.69 64.23,71.49
N$13  (via drill 0.61)
  Top 0.61: v29.08,124.93 29.08,117.31 30.4,115.99 30.4,108.42 IC4.3 | v30.7,133.06 30.7,145.05 30.5,145.25 30.5,146.47 33.29,149.26 IC7.8
  Bottom 0.61: v29.08,124.93 29.08,131.43 v30.7,133.06
N$14
  Top 0.61: R22.2 24.51,18.15 19.02,18.15 18.61,18.55 Q3.B
N$15  (via drill 0.61)
  Top 0.61: v52.13,11.68 52.13,23.68 50.88,24.93 50.88,27.18 IC6.1
  Bottom 0.61: v52.13,11.68 50.13,9.68 50.13,9.43 46.38,5.68 43.38,5.68 42.38,6.68 X7.2
N$16  (via drill 0.61)
  Top 0.61: v38.93,28.31 25.62,28.31 R22.1
  Bottom 0.61: v38.93,28.31 38.73,28.51 38.73,32.27 IC2.5
N$17  (via drill 0.61)
  Top 0.61: v43.3,17.03 43.51,16.83 46.15,16.83 50.82,21.5 50.82,22.01 IC6.16 | v24.61,13.78 22.17,11.34 18.61,11.34 v18.41,11.54
  Bottom 0.61: v43.3,17.03 27.86,17.03 v24.61,13.78 | v18.41,11.54 18.71,11.54 19.12,11.14 27.35,11.14 29.99,8.5 29.99,7.18 30.7,6.46 32.43,6.46 32.63,6.67 X8.2
N$18  (via drill 0.61)
  Top 0.61: v27.66,8.8 27.66,10.63 v29.69,12.66 | v32.63,15.61 v32.63,19.67
  Bottom 0.61: v27.66,8.8 27.66,6.67 26.44,5.45 24.61,5.45 23.49,6.57 23.49,6.67 X3.2 | v29.69,12.66 v32.63,15.61 | v32.63,19.67 32.84,19.47 37.1,19.47 40.46,22.82 40.46,31.66 41.07,32.27 IC2.6
N$19
  Top 1.016: X5.2 13.88,6.68 12.38,6.68 11.38,7.68 11.38,14.18 15.38,18.18 Q3.C
N$20
  Top 1.27: 64.03,66.51 71.65,66.51
N$22  (via drill 0.61)
  Top 0.61: v28.47,112.13 28.47,108.27 IC4.4 | v31.92,112.13 32.33,112.13 35.78,115.58 37.41,115.58 v39.24,117.41 | v37.61,130.62 38.63,131.64 v38.63,147.28
  Bottom 0.61: v28.47,112.13 28.67,111.93 31.72,111.93 v31.92,112.13 | v39.24,117.41 39.24,118.02 37.61,119.65 v37.61,130.62 | v38.63,147.28 38.63,147.49 40.86,149.72 IC7.7
N$23
  Top 0.61: IC6.2 49.63,28.18 49.63,28.93 49.88,29.18 51.63,29.18 56.38,24.43 56.38,7.18 54.88,5.68 53.38,5.68 52.63,6.43 52.63,6.68 X6.2
N$25  (via drill 0.61)
  Top 0.61: IC6.9 v41.88,24.55
  Bottom 0.61: v41.88,24.55 41.88,26.07 47.87,32.07 47.87,34.91 44.01,38.77 39.95,38.77 38.83,39.89 IC2.12
N$26
  Top 0.914: R21.2 38.63,13.58 46.15,13.58 46.76,12.97 Q2.B
N$27
  Top 0.914: X20.2 32.74,23.53 34.97,23.53 41.68,16.83 41.68,16.42 42.69,15.41 46.76,15.41 Q2.C
N$28
  Top 0.61: R17.1 48.59,141.19 46.15,138.75 | 46.15,138.75 44.72,137.33 43.3,137.33 IC7.2 | R15.2 52.65,131.84 52.65,132.25 46.15,138.75
N$29
  Top 0.61: X14.3 R13.1
  Bottom 0.61: R13.1 14.24,142.41 18.92,142.41 21.36,139.97 33.35,139.97 IC7.12 35.58,139.97 36.8,141.19 36.8,147.49 40.66,151.35 43.51,151.35 50.01,144.84 56.51,144.84 R9.2
N$31
  Bottom 0.61: R8.S 44.12,79.82 44.12,89.57 44.72,90.18 R12.1
N$32  (via drill 0.61)
  Top 0.61: R18.1 45.94,141.39 44.32,139.76 43.3,139.76 IC7.3 41.07,138.95 39.85,137.73 39.85,129.2 R16.2 34.36,124.52 32.94,125.95 32.94,128.18 29.28,131.84 29.28,141.8 v20.75,150.33 | v13.84,150.33 12.62,151.55 8.96,151.55 X13.3
  Bottom 0.61: v20.75,150.33 v13.84,150.33
N$58
  Top 0.61: R3.2 58.75,78.4 58.75,80.02 57.53,81.24 IC5.2 | R6.E 51.23,69.66 51.23,72.91 49.2,74.94 R4.2
  Bottom 0.61: IC5.2 55.29,81.45 55.09,81.45 49.4,75.76 R4.2
N$60
  Top 0.61: X19.2 69.31,81.85 69.31,78.4 R3.1
N$62
  Bottom 0.61: R7.S 54.28,69.66 54.28,71.9 57.53,75.15 58.54,75.15 R4.1
N$63
  Top 0.61: R5.E 54.28,95.26 54.28,91.81 54.88,91.2 R12.2
  Bottom 0.61: IC5.6 50.01,84.7 54.88,89.57 54.88,90.18 R12.2 55.7,90.18 56.31,90.18 58.14,88.35 58.54,88.35 R11.2
N$69
  Top 0.61: X17.2 69.31,92.01 69.31,88.56 R11.1
N$74
  Top 0.61: X18.2 IC14.3
N$83
  Top 0.61: Q1.1 56.92,35.52 58.75,37.35 IC14.1
N$84
  Top 0.61: Q1.2 61.59,35.73 61.59,37.35 IC14.2
N$113  (via drill 0.61)
  Top 0.61: IC3.2 26.03,88.35 22.37,88.35 21.56,89.17 R32.E | R24.2 18.11,147.28 21.97,147.28 28.06,141.19 28.06,130.82 30.3,128.59 R25.2 | v38.63,104.81 39.24,105.42 39.24,108.27 v41.68,110.71
  Bottom 0.61: v38.63,104.81 20.14,104.81 16.28,100.95 16.28,94.45 20.75,89.98 R32.E | v41.68,110.71 30.91,121.48 30.91,127.57 R25.2
N$114  (via drill 0.61)
  Top 0.61: 61.54,115.79 59.36,117.97 R27.2 | 61.54,115.79 62.96,114.36 62.96,113.7 R26.2 | R33.E 19.98,77.33 19.98,74.99 21.66,73.32 28.62,73.32 29.54,74.23 29.54,76.57 28.52,77.58 IC3.6 | v70.73,115.53 70.02,115.53 67.58,117.97 67.13,117.97 66.62,118.48 64.23,118.48 61.54,115.79 | v64.59,62.04 v67.63,65.09 | v38.32,64.28 35.28,67.32 35.28,69.61 v35.48,69.81
  Bottom 0.61: v70.73,115.53 72.51,113.75 74.65,113.75 75.46,112.94 75.46,78.96 72.36,75.86 70.07,75.86 68.91,74.69 68.91,66.66 67.63,65.39 v67.63,65.09 | v64.59,62.04 64.38,61.84 60.68,61.84 59.36,60.52 42.08,60.52 v38.32,64.28 | v35.48,69.81 36.5,70.83 36.5,72.3 35.12,73.67 32.53,73.67 28.57,77.64 IC3.6
N$115  (via drill 0.61)
  Top 0.61: 37.16,75.76 37.16,69.66 R34.E | 37.16,75.76 37.16,76.06 35.89,77.33 IC3.9 | v42.69,86.02 52.34,95.67 52.34,96.94 55.49,100.09 55.49,104.56 58.75,107.81 R29.2 | 37.16,75.76 v39.64,75.76
  Top 0.914: R28.2 55.7,117.21 55.7,111.93 58.75,108.88 R29.2
  Bottom 0.61: v39.64,75.76 39.64,79.16 42.69,82.21 v42.69,86.02
N$116
  Top 0.61: IC3.13 36.19,88.35 39.44,91.61 R35.E 40.46,92.22 42.69,92.22 44.72,94.25 44.72,95.26 R30.2
  Bottom 0.61: R31.2 58.54,98.51 53.66,98.51 52.24,99.94 49.4,99.94 45.54,96.08 R30.2
N$117
  Top 0.61: X9.2 69.21,102.07 R31.1
N$119
  Top 0.61: X10.2 69.21,112.23 R29.1
N$121
  Top 0.61: R30.1 45.54,106.24 48.99,106.24 49.6,106.85 R39.S
N$122
  Top 0.61: R38.S 47.21,115.28 47.21,115.53 45.59,117.16 R28.1
N$123
  Top 0.61: R26.1 52.8,113.7 52.8,116.04 47.93,120.92 47.93,122.85 R37.S
N$124
  Top 0.61: X11.2 69.21,122.39 R27.1
N$125
  Top 0.61: X12.2 6.93,134.89 6.93,136.11 7.95,137.12 17.09,137.12 R24.1
N$126
  Top 0.61: R25.1 31.11,118.02 36.6,118.02 R36.S
RS  (via drill 0.61)
  Top 0.61: v15.87,56.86 14.85,56.86 9.57,51.58 6.32,51.58 IC1.18.J6 | v17.29,77.99 17.29,80.84 14.04,84.09 14.04,88.76 11.4,91.4 X1.7
  Bottom 0.61: v15.87,56.86 18.92,59.91 18.92,72.71 19.32,73.11 19.32,75.96 v17.29,77.99
SCL  (via drill 0.61)
  Top 0.61: v23.59,134.48 19.32,130.21 IC17.10 | v41.07,128.38 41.07,130.21 41.88,131.03 44.52,131.03 45.74,129.81 49.6,129.81 v51.23,131.43 | v67.53,119.6 67.23,119.6 67.03,119.8 63.98,119.8 v59.91,123.86 | X19.4 69.41,83.78 70.07,83.78 72.82,81.04 74.19,81.04 75.15,80.07 75.15,61.33 73.32,59.5 R2.2 | IC14.6 64.33,47.41 64.33,55.13 67.79,58.59 72.46,58.59 R2.2 | IC1.13.J7 74.63,40.18 74.63,57.18 73.38,58.43 R2.2 | v15.26,105.42 20.14,100.55 IC4.10 | X2.4 6.93,124.12 6.73,124.12 5.91,124.93 5.91,131.64 6.93,132.65 X12.4 | X7.4 44.12,6.67 44.12,6.46 43.3,5.65 35.38,5.65 34.97,6.06 34.56,6.26 | v46.76,25.97 46.96,25.77 IC6.13 | v47.77,36.94 48.59,36.94 49.8,38.16 v49.8,48.32
  Top 0.914: 25.42,6.67 24.2,5.45 22.78,5.45 21.56,6.67 15.87,6.67 X5.4 | 25.42,6.67 X3.4 | X8.4 34.56,6.67 34.56,6.26 33.75,5.45 31.31,5.45 30.3,6.46 25.83,6.46 25.42,6.67 | v36.8,9.92 36.8,12.56 34.36,15 v34.36,21.91 | v30.09,31.05 26.23,31.05 22.58,34.71 22.58,36.34 24.81,38.57 31.72,38.57 33.14,39.99 IC2.14 | X4.4 64.03,6.67 69.52,6.67 69.72,6.46 73.78,6.46 74.8,7.48 74.8,36.74 73.38,38.16 IC1.13.J7
  Bottom 0.61: v41.07,128.38 41.07,129.2 38.22,132.04 33.75,132.04 31.31,134.48 v23.59,134.48 | v51.23,131.43 51.23,132.04 54.28,135.09 59.15,135.09 J1.2 59.91,134.78 v59.91,123.86 | X19.4 69.21,84.29 69.21,85.87 67.63,87.44 67.63,88.96 70.38,91.71 70.38,93.03 69.41,93.99 X17.4 69.21,94.45 69.21,96.03 67.63,97.6 67.63,99.12 70.38,101.87 70.38,103.19 69.41,104.15 X9.4 69.21,104.61 69.21,106.19 67.63,107.76 67.63,109.28 70.38,112.03 70.38,113.35 69.41,114.31 X10.4 69.21,114.77 69.21,115.79 67.63,117.36 67.63,119.24 67.79,119.39 | 67.79,119.39 70.38,121.98 70.38,123.51 69.46,124.42 69.41,124.42 X11.4 | v67.53,119.6 67.58,119.6 67.79,119.39 | v15.26,105.42 11.6,105.42 X1.2 11.4,106.44 12.62,107.66 12.62,117.82 9.57,120.87 9.57,121.68 9.37,121.88 | 9.37,121.88 7.74,121.88 6.93,122.7 6.93,123.71 X2.4 | 9.37,121.88 17.09,129.6 IC17.10 | v46.76,25.97 46.76,29.22 48.99,31.46 48.99,35.73 v47.77,36.94 | 49.8,48.73 v49.8,48.32 | X6.4 54.48,6.87 60.37,6.87 61.59,5.65 63.01,5.65 64.03,6.67 X4.4
  Bottom 0.914: v36.8,9.92 37,9.72 37,7.68 35.99,6.67 34.77,6.67 X8.4 | v34.36,21.91 34.36,26.78 v30.09,31.05 | IC14.6 63.62,47.31 62.2,48.73 49.8,48.73 33.96,48.73 32.94,47.71 32.94,42.43 33.14,42.23 IC2.14
SDA  (via drill 0.61)
  Top 0.61: IC14.5 66.87,47.31 66.87,55.03 67.69,55.84 R1.2 68.5,56.45 69.92,56.45 IC1.21.J7 | X12.3 8.96,133.87 16.07,133.87 17.09,132.86 IC17.9 | 15.67,9.92 15.87,10.12 23.18,10.12 24.3,9 X3.3 | 15.67,9.92 14.85,9.11 14.85,8.9 X5.3 | v31.21,11.24 31.52,11.24 33.75,9 X8.3 | 23.18,22.11 24.1,22.11 32.94,13.27 v33.24,13.27 | v16.89,22.11 23.18,22.11 | 15.67,9.92 v15.26,10.32 | v60.57,11.54 60.57,14.8 v68.4,22.62 | 23.18,22.11 v23.18,30.85 | v45.74,20.82 45.74,21.5 45.69,21.55 45.69,21.91 45.72,21.93 45.72,21.96 IC6.12
  Top 0.813: 62.4,83.07 v63.62,83.07 | 62.4,93.23 v62.61,93.23 | v64.44,123.71 67.08,123.71 X11.3 | v35.17,103.39 38.02,106.24 38.02,109.08 39.64,110.71 | 39.64,110.71 41.07,112.13 42.49,112.13 44.12,110.5 v48.99,110.5 | v21.97,116.8 21.97,115.38 v26.44,110.91 | v33.14,110.91 34.36,110.91 36.19,112.74 37.61,112.74 39.64,110.71
  Top 0.914: v6.22,69.56 6.22,107.86 7.34,108.98 8.86,108.98 8.96,108.88 10.18,108.88 X1.1 | v11.5,62.04 14.85,62.04 v21.56,55.33 | v54.99,17.03 54.99,16.22 v53.46,14.69 | v62.4,100.14 62.4,93.23 62.4,83.07 62.4,78.8 v65.04,76.16 | v68.5,76.16 72.77,76.16 v73.78,75.15
  Bottom 0.61: v31.21,11.24 31.52,11.24 33.4,13.12 | 33.4,13.12 36.09,15.81 39.54,15.81 42.18,13.17 | 42.18,13.17 43.3,12.05 43.3,9.21 43.51,9 43.51,8.9 X7.3 | 46.15,17.13 51.23,17.13 53.56,14.8 56,12.36 56,10.83 55.19,10.02 54.28,10.02 53.26,9 X6.3 | 42.18,13.17 46.15,17.13 | v15.26,10.32 15.26,15 13.33,16.93 12.82,16.93 11.4,18.35 11.4,20.89 12.62,22.11 v16.89,22.11 | v33.24,13.27 33.4,13.12 | v60.57,11.54 63.01,9.11 63.01,8.9 X4.3 | v68.4,22.62 68.4,43.45 66.87,44.97 IC14.5 | v23.18,30.85 26.64,34.3 26.64,35.62 30.91,39.89 IC2.15 | v45.74,20.82 45.74,17.69 46.02,17.41 46.15,17.13 | X2.3 9.77,124.93 16.68,131.84 16.99,132.04
  Bottom 0.813: v63.62,83.07 67.08,83.07 X19.3 | v62.61,93.23 67.08,93.23 X17.3 | X9.3 67.08,103.39 61.59,103.39 | X10.3 67.08,113.55 66.67,113.55 63.93,116.29 | 64.03,123.71 v64.44,123.71 | v35.17,103.39 21.36,103.39 18.51,100.55 IC4.9 | 61.59,110.5 v48.99,110.5 | v21.97,116.8 21.97,129.4 19.32,132.04 IC17.9 | v26.44,110.91 27.66,110.91 27.86,110.71 32.94,110.71 v33.14,110.91
  Bottom 0.914: v6.22,69.56 6.22,67.32 v11.5,62.04 | v21.56,55.33 21.56,51.07 29.18,43.45 29.38,43.45 30.6,42.23 IC2.15 | v54.99,17.03 60.17,11.85 v60.57,11.54 | 53.56,14.8 v53.46,14.69 | IC17.9 16.99,132.04 | v62.4,100.14 61.59,100.95 61.59,103.39 61.59,110.5 61.59,113.96 63.93,116.29 64.03,116.4 64.03,123.71 64.03,134.89 62.61,136.31 J1.3 | v68.5,76.16 v65.04,76.16 | v73.78,75.15 74.19,74.74 74.19,62.55 70.73,59.09 70.73,56.86 IC1.21.J7
V-  (via drill 0.61)
  Top 0.61: v39.44,83.27 42.08,83.27 47.37,88.56 53.06,88.56 54.48,87.14 55.29,87.14 IC5.4
  Top 0.914: v35.99,130.62 35.99,131.23 36.8,132.04 36.8,140.37 35.58,141.59 IC7.11 | v40.86,122.29 v36.19,122.29 | v58.14,111.93 60.78,109.28 60.78,92.42 57.32,88.96 57.32,87.34 IC5.4 57.53,86.32 60.78,83.07 60.78,78.4 63.22,75.96 63.22,74.74 X16.4
  Bottom 0.61: v39.44,83.27 36.19,83.27 IC3.11
  Bottom 0.914: v35.99,130.62 35.58,130.62 32.74,127.78 32.74,123.51 33.96,122.29 v36.19,122.29 | v40.86,122.29 46.35,122.29 46.96,121.68 48.38,121.68 49.4,122.7 50.82,122.7 53.66,119.85 53.66,116.4 v58.14,111.93